# Altium project Tiresias.PrjPcb (part 1 of 2)
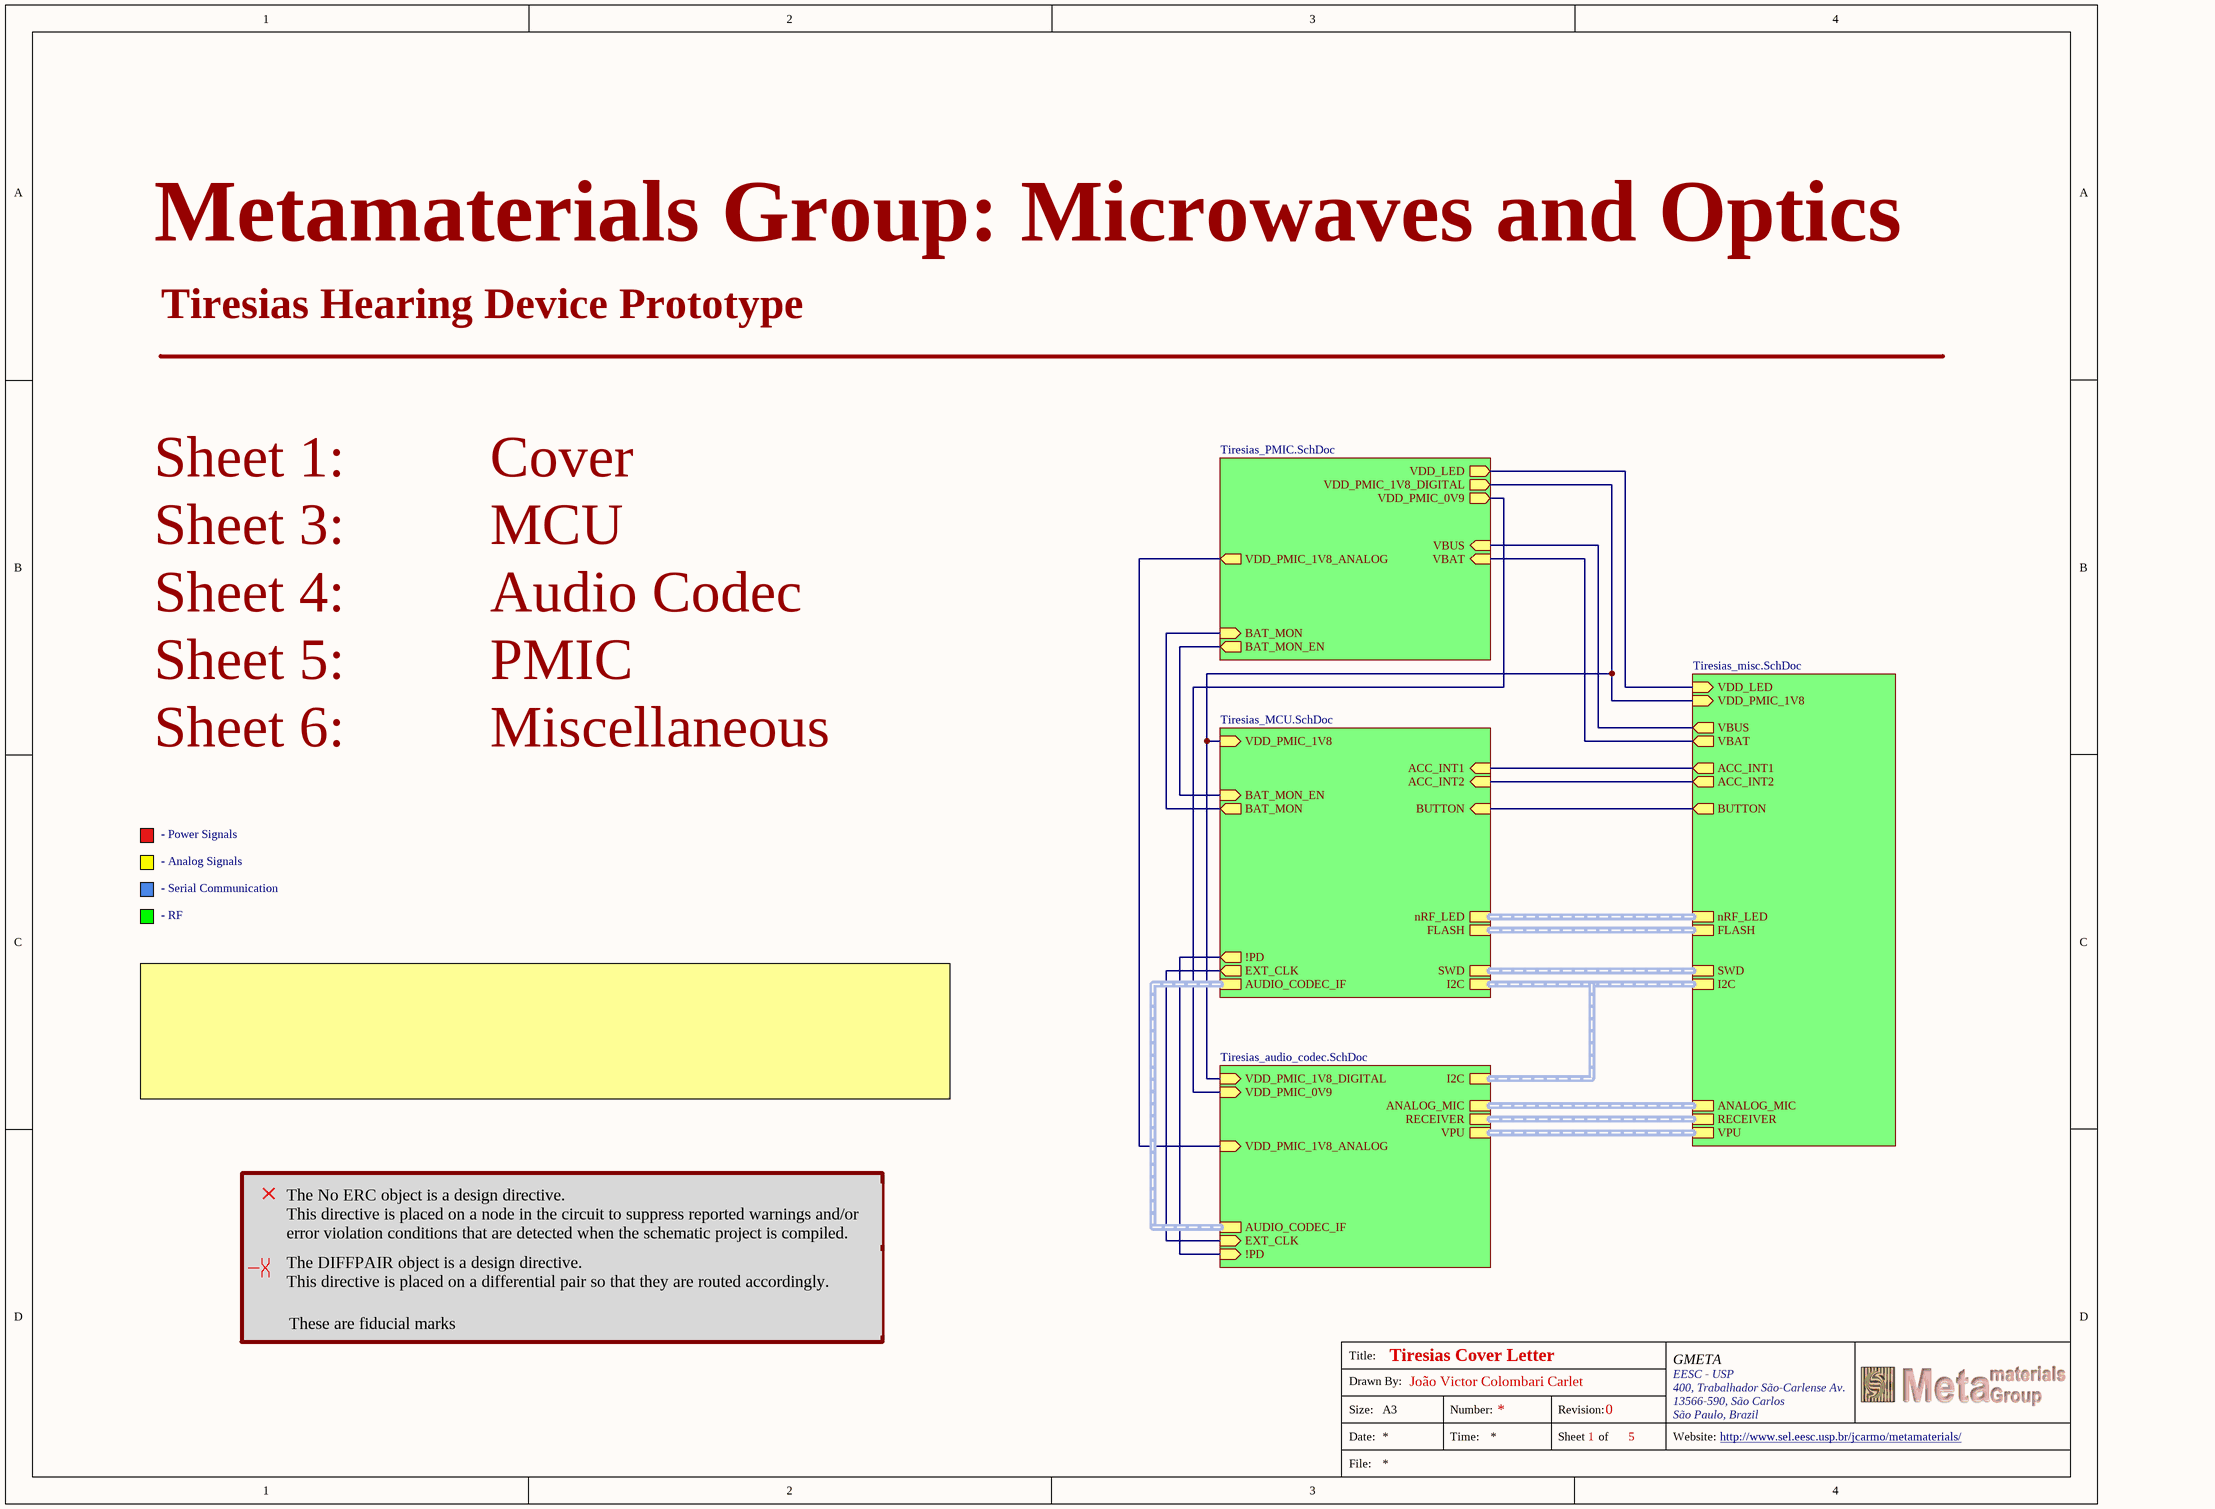
[diagram p0: Tiresias_Cover_letter.SchDoc]
5 sheets, 175 parts. Net scope: hierarchical (ports join the sheet entries above them; power ports are global).
Board file: Tiresias_PCB.PcbDoc
Sheets:
  Tiresias_Cover_letter.SchDoc
    U_Tiresias_MCU = Tiresias_MCU.SchDoc
    U_Tiresias_audio_codec = Tiresias_audio_codec.SchDoc
    U_Tiresias_PMIC = Tiresias_PMIC.SchDoc
    U_Tiresias_misc = Tiresias_misc.SchDoc

## Sheet Tiresias_Cover_letter.SchDoc: Tiresias Cover Letter
size 393 x 281 mm; Author: João Victor Colombari Carlet; CompanyName: GMETA; DrawnBy: João Victor Colombari Carlet; Organization: GMETA; Address1: EESC - USP; Address2: 400, Trabalhador São-Carlense Av.; Address3: 13566-590, São Carlos; Address4: São Paulo, Brazil; Revision: 0; SheetNumber: 1; SheetTotal: 5; Company: USP - GMETA; Address_Website: http://www.sel.eesc.usp.br/jcarmo/metamaterials/

### Sub-sheets
U_Tiresias_audio_codec = Tiresias_audio_codec.SchDoc: RECEIVER (harness RECEIVER), ANALOG_MIC (harness ANALOG_MIC), VPU (harness VPU), AUDIO_CODEC_IF (harness AUDIO_CODEC), I2C (harness I2C), EXT_CLK (in), VDD_PMIC_0V9 (in), !PD (in), VDD_PMIC_1V8_ANALOG (in), VDD_PMIC_1V8_DIGITAL (in)
U_Tiresias_MCU = Tiresias_MCU.SchDoc: SWD (harness SWD), FLASH (harness FLASH), AUDIO_CODEC_IF (harness AUDIO_CODEC), BUTTON (in), VDD_PMIC_1V8 (in), !PD (out), ACC_INT1 (in), ACC_INT2 (in), I2C (harness I2C), EXT_CLK (out), nRF_LED (harness nRF_LED), BAT_MON (out), BAT_MON_EN (in)
U_Tiresias_misc = Tiresias_misc.SchDoc: FLASH (harness FLASH), SWD (harness SWD), BUTTON (out), RECEIVER (harness RECEIVER), ANALOG_MIC (harness ANALOG_MIC), VPU (harness VPU), nRF_LED (harness nRF_LED), VDD_LED (in), ACC_INT1 (out), ACC_INT2 (out), I2C (harness I2C), VBUS (out), VBAT (out), VDD_PMIC_1V8 (in)
U_Tiresias_PMIC = Tiresias_PMIC.SchDoc: VBUS (in), VBAT (in), BAT_MON_EN (out), BAT_MON (in), VDD_LED (out), VDD_PMIC_0V9 (out), VDD_PMIC_1V8_DIGITAL (out), VDD_PMIC_1V8_ANALOG (out)

### Nets
VDD: sheet U_Tiresias_MCU/VDD_PMIC_1V8, sheet U_Tiresias_audio_codec/VDD_PMIC_1V8_DIGITAL, sheet U_Tiresias_PMIC/VDD_PMIC_1V8_DIGITAL, sheet U_Tiresias_misc/VDD_PMIC_1V8
AVDD: sheet U_Tiresias_audio_codec/VDD_PMIC_1V8_ANALOG, sheet U_Tiresias_PMIC/VDD_PMIC_1V8_ANALOG
DVDD_EXT: sheet U_Tiresias_audio_codec/VDD_PMIC_0V9, sheet U_Tiresias_PMIC/VDD_PMIC_0V9
P0.02/NFC1: sheet U_Tiresias_MCU/ACC_INT1, sheet U_Tiresias_misc/ACC_INT1
P0.03/NFC2: sheet U_Tiresias_MCU/ACC_INT2, sheet U_Tiresias_misc/ACC_INT2
P0.29: sheet U_Tiresias_MCU/BUTTON, sheet U_Tiresias_misc/BUTTON
P1.00: sheet U_Tiresias_MCU/!PD, sheet U_Tiresias_audio_codec/!PD
P1.01: sheet U_Tiresias_MCU/EXT_CLK, sheet U_Tiresias_audio_codec/EXT_CLK
P1.04: sheet U_Tiresias_MCU/BAT_MON, sheet U_Tiresias_PMIC/BAT_MON
P1.05: sheet U_Tiresias_MCU/BAT_MON_EN, sheet U_Tiresias_PMIC/BAT_MON_EN
VBAT: sheet U_Tiresias_PMIC/VBAT, sheet U_Tiresias_misc/VBAT
VBUS: sheet U_Tiresias_PMIC/VBUS, sheet U_Tiresias_misc/VBUS
VSYS: sheet U_Tiresias_PMIC/VDD_LED, sheet U_Tiresias_misc/VDD_LED

### Buses and harness runs
harness sheet U_Tiresias_audio_codec/ANALOG_MIC = sheet U_Tiresias_misc/ANALOG_MIC
harness sheet U_Tiresias_audio_codec/AUDIO_CODEC_IF = sheet U_Tiresias_MCU/AUDIO_CODEC_IF
harness sheet U_Tiresias_audio_codec/I2C = sheet U_Tiresias_MCU/I2C = sheet U_Tiresias_misc/I2C
harness sheet U_Tiresias_audio_codec/RECEIVER = sheet U_Tiresias_misc/RECEIVER
harness sheet U_Tiresias_audio_codec/VPU = sheet U_Tiresias_misc/VPU
harness sheet U_Tiresias_MCU/FLASH = sheet U_Tiresias_misc/FLASH
harness sheet U_Tiresias_MCU/nRF_LED = sheet U_Tiresias_misc/nRF_LED
harness sheet U_Tiresias_MCU/SWD = sheet U_Tiresias_misc/SWD

### Layout directives
differential pair: (no net found under the mark)

### Notes on the sheet
- Metamaterials Group: Microwaves and Optics
- Tiresias Hearing Device Prototype
- Sheet 1:          Cover
- Sheet 3:          MCU
- Sheet 4:          Audio Codec
- Sheet 5:          PMIC
- Sheet 6:          Miscellaneous
- - Power Signals
- - Analog Signals
- - Serial Communication
- - RF
- The No ERC object is a design directive.
  This directive is placed on a node in the circuit to suppress reported warnings and/or error violation conditions that are detected when the schematic project is compiled.
- The DIFFPAIR object is a design directive.
  This directive is placed on a differential pair so that they are routed accordingly.
- These are fiducial marks
- Title:
- Drawn By:
- Size:
- Date:
- File:
- A3
- Number:
- Time:
- Revision:
- Sheet
- of
- Website:

## Sheet Tiresias_MCU.SchDoc: MCU
size 393 x 281 mm; Author: João Victor Colombari Carlet; CompanyName: GMETA; DrawnBy: João Victor Colombari Carlet; Organization: GMETA; Address1: EESC - USP; Address2: 400, Trabalhador São-Carlense Av.; Address3: 13566-590, São Carlos; Address4: São Paulo, Brazil; Revision: 0; SheetNumber: 2; SheetTotal: 5; Address_Website: http://www.sel.eesc.usp.br/jcarmo/metamaterials/
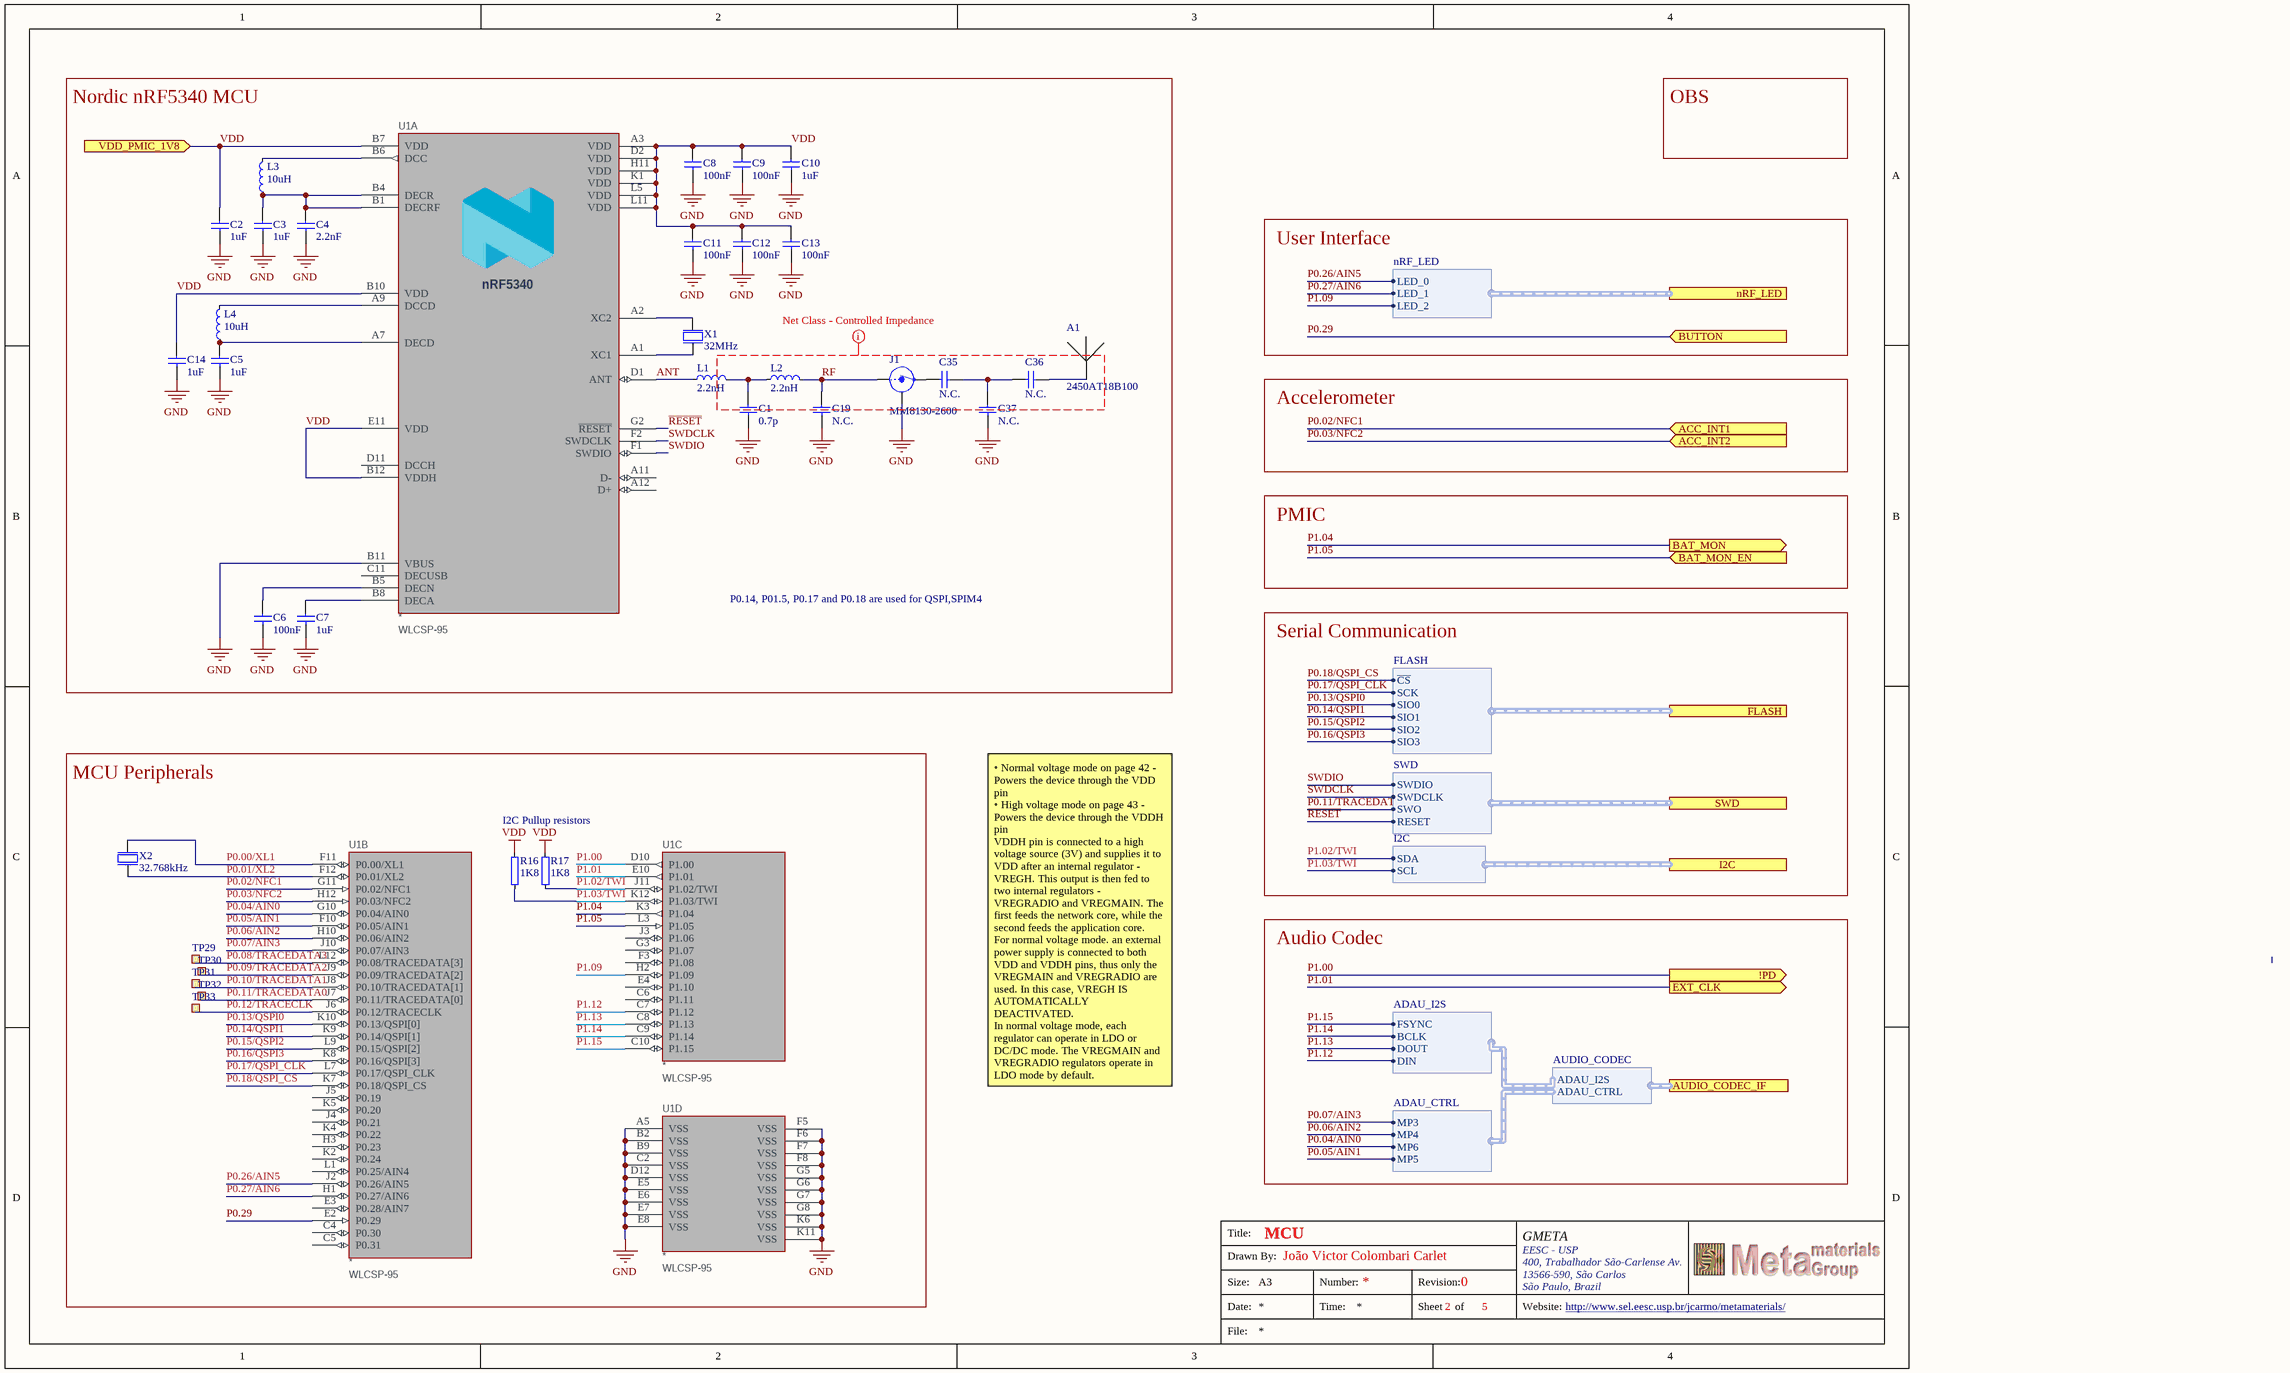
[diagram p1: Tiresias_MCU.SchDoc]

### Parts
A1  2450AT18B100  [2450AT18B100]
C1  0.7p  [CAPC0603X03L_C]
C2  1uF  [CAPC1005X04L]
C3  1uF  [CAPC1005X04L]
C4  2.2nF  [CAPC0603X03L_C]
C5  1uF  [CAPC1005X04L]
C6  100nF  [CAPC0603X03L_C]
C7  1uF  [CAPC1005X04L]
C8  100nF  [CAPC0603X03L_C]
C9  100nF  [CAPC0603X03L_C]
C10  1uF  [CAPC1005X04L]
C11  100nF  [CAPC0603X03L_C]
C12  100nF  [CAPC0603X03L_C]
C13  100nF  [CAPC0603X03L_C]
C14  1uF  [CAPC1005X04L]
C19  N.C.  [CAPC0603X03L_C_NC]
C35  N.C.  [CAPC0603X03L_C_NC]
C36  N.C.  [CAPC0603X03L_C_NC]
C37  N.C.  [CAPC0603X03L_C_NC]
J1  MM8130-2600  [COAXIAL-SWF]
L1  2.2nH  [INDC0603X03L_C]
L2  2.2nH  [INDC0603X03L_C]
L3  10uH  [INDC1608X06L]
L4  10uH  [INDC1608X06L]
R16  1K8  [RESC0603X03L_C]
R17  1K8  [RESC0603X03L_C]
TP29  Ø1.0mm,SMD  [TP_SMD_D1.0mm]  (value not drawn)  (no BOM)
TP30  Ø1.0mm,SMD  [TP_SMD_D1.0mm]  (value not drawn)  (no BOM)
TP31  Ø1.0mm,SMD  [TP_SMD_D1.0mm]  (value not drawn)  (no BOM)
TP32  Ø1.0mm,SMD  [TP_SMD_D1.0mm]  (value not drawn)  (no BOM)
TP33  Ø1.0mm,SMD  [TP_SMD_D1.0mm]  (value not drawn)  (no BOM)
U1  *  Package: WLCSP-95  [BGA95C35P12X11_437X397X50]  (parts A,B,C,D of 4)
X1  32MHz  [BT-XTAL_2016]
X2  32.768kHz  [XTAL_2012]

### Blocks framed on the sheet
Nordic nRF5340 MCU: A1 C1-C14 C19 C35-C37 J1 L1-L4 U1 X1
MCU Peripherals: R16 R17 TP29-TP33 U1 X2

### Ports
!PD (out, see Tiresias_Cover_letter[3C], Tiresias_audio_codec[1C]), ACC_INT1 (in, see Tiresias_Cover_letter[3C], Tiresias_misc[4D]), ACC_INT2 (in, see Tiresias_Cover_letter[3C], Tiresias_misc[4C]), AUDIO_CODEC_IF (harness AUDIO_CODEC, see Tiresias_Cover_letter[3C], Tiresias_audio_codec[3B]), BAT_MON (out, see Tiresias_Cover_letter[3C], Tiresias_PMIC[1C]), BAT_MON_EN (in, see Tiresias_Cover_letter[3C], Tiresias_PMIC[2C]), BUTTON (in, see Tiresias_Cover_letter[3C], Tiresias_misc[2B]), EXT_CLK (out, see Tiresias_Cover_letter[3C], Tiresias_audio_codec[2D]), FLASH (harness FLASH, see Tiresias_Cover_letter[3C], Tiresias_misc[3C]), I2C (harness I2C, see Tiresias_Cover_letter[3C], Tiresias_audio_codec[3C], Tiresias_misc[2C]), nRF_LED (harness nRF_LED, see Tiresias_Cover_letter[3C], Tiresias_misc[1B]), SWD (harness SWD, see Tiresias_Cover_letter[3C], Tiresias_misc[2A]), VDD_PMIC_1V8 (in, see Tiresias_Cover_letter[3B], Tiresias_misc[1A])

### Harnesses
SWD: SWDIO, SWDCLK, SWO, RESET
FLASH: ~{CS}, SCK, SIO0, SIO1, SIO2, SIO3
ADAU_I2S: FSYNC, BCLK, DOUT, DIN
ADAU_CTRL: MP3, MP4, MP6, MP5
AUDIO_CODEC: ADAU_I2S, ADAU_CTRL
I2C: SDA, SCL
nRF_LED: LED_0, LED_1, LED_2

### Nets
GND: C1.1 C2.1 C3.1 C4.1 C5.1 C6.1 C7.1 C8.1 C9.1 C10.1 C11.1 C12.1 C13.1 C14.1 C19.1 C37.1 J1.2(Shield) U1.A5(VSS) U1.B2(VSS) U1.B9(VSS) U1.B11(VBUS) U1.C2(VSS) U1.D12(VSS) U1.E5(VSS) U1.E6(VSS) U1.E7(VSS) U1.E8(VSS) U1.F5(VSS) U1.F6(VSS) U1.F7(VSS) U1.F8(VSS) U1.G5(VSS) U1.G6(VSS) U1.G7(VSS) U1.G8(VSS) U1.K6(VSS) U1.K11(VSS) X1.2(GND) X1.4(GND)
VDD: C2.2 C8.2 C9.2 C10.2 C11.2 C12.2 C13.2 C14.2 R16.2 R17.2 U1.A3(VDD) U1.B7(VDD) U1.B10(VDD) U1.B12(VDDH) U1.D2(VDD) U1.E11(VDD) U1.H11(VDD) U1.K1(VDD) U1.L5(VDD) U1.L11(VDD) ; port VDD_PMIC_1V8
ANT: L1.1 U1.D1(ANT)
P0.00/XL1: U1.F11(P0.00/XL1) X2.2(out)
P0.01/XL2: U1.F12(P0.01/XL2) X2.1(inp)
P0.02/NFC1: U1.G11(P0.02/NFC1) ; port ACC_INT1
P0.03/NFC2: U1.H12(P0.03/NFC2) ; port ACC_INT2
P0.04/AIN0: U1.G10(P0.04/AIN0) ; harness ADAU_CTRL.MP6
P0.05/AIN1: U1.F10(P0.05/AIN1) ; harness ADAU_CTRL.MP5
P0.06/AIN2: U1.H10(P0.06/AIN2) ; harness ADAU_CTRL.MP4
P0.07/AIN3: U1.J10(P0.07/AIN3) ; harness ADAU_CTRL.MP3
P0.08/TRACEDATA3: TP29.1 U1.L12(P0.08/TRACEDATA[3])
P0.09/TRACEDATA2: TP30.1 U1.J9(P0.09/TRACEDATA[2])
P0.10/TRACEDATA1: TP31.1 U1.J8(P0.10/TRACEDATA[1])
P0.11/TRACEDATA0: TP32.1 U1.J7(P0.11/TRACEDATA[0]) ; port SWD.SWO
P0.12/TRACECLK: TP33.1 U1.J6(P0.12/TRACECLK)
P0.13/QSPI0: U1.K10(P0.13/QSPI[0]) ; port FLASH.SIO0
P0.14/QSPI1: U1.K9(P0.14/QSPI[1]) ; port FLASH.SIO1
P0.15/QSPI2: U1.L9(P0.15/QSPI[2]) ; port FLASH.SIO2
P0.16/QSPI3: U1.K8(P0.16/QSPI[3]) ; port FLASH.SIO3
P0.17/QSPI_CLK: U1.L7(P0.17/QSPI_CLK) ; port FLASH.SCK
P0.18/QSPI_CS: U1.K7(P0.18/QSPI_CS) ; port FLASH.~{CS}
P0.26/AIN5: U1.J2(P0.26/AIN5) ; port nRF_LED.LED_0
P0.27/AIN6: U1.H1(P0.27/AIN6) ; port nRF_LED.LED_1
P0.29: U1.E2(P0.29) ; port BUTTON
P1.00: U1.D10(P1.00) ; port !PD
P1.01: U1.E10(P1.01) ; port EXT_CLK
P1.02/TWI: R17.1 U1.J11(P1.02/TWI) ; port I2C.SDA
P1.03/TWI: R16.1 U1.K12(P1.03/TWI) ; port I2C.SCL
P1.04: U1.K3(P1.04) ; port BAT_MON
P1.05: U1.L3(P1.05) ; port BAT_MON_EN
P1.09: U1.H2(P1.09) ; port nRF_LED.LED_2
P1.12: U1.C7(P1.12) ; harness ADAU_I2S.DIN
P1.13: U1.C8(P1.13) ; harness ADAU_I2S.DOUT
P1.14: U1.C9(P1.14) ; harness ADAU_I2S.BCLK
P1.15: U1.C10(P1.15) ; harness ADAU_I2S.FSYNC
~{RESET}: U1.G2(~{RESET}) ; port SWD.RESET
RF: C19.2 J1.1(IN) L2.2
SWDCLK: U1.F2(SWDCLK) ; port SWD.SWDCLK
SWDIO: U1.F1(SWDIO) ; port SWD.SWDIO
NetA1_1: A1.1 C36.1
NetC1_2: C1.2 L1.2 L2.1
NetC3_2: C3.2 C4.2 L3.1 U1.B1(DECRF) U1.B4(DECR)
NetC5_2: C5.2 L4.1 U1.A7(DECD)
NetC6_2: C6.2 U1.B5(DECN)
NetC7_2: C7.2 U1.B8(DECA)
NetC35_1: C35.1 J1.3(OUT)
NetC35_2: C35.2 C36.2 C37.2
NetL3_2: L3.2 U1.B6(DCC)
NetL4_2: L4.2 U1.A9(DCCD)
NetU1_A1: U1.A1(XC1) X1.1(inp)
NetU1_A2: U1.A2(XC2) X1.3(out)

Not connected (* = marked no-connect by the designer): U1 A11(D-) A12(D+) C4(P0.30) C5(P0.31) C6(P1.11) C11(DECUSB) D11(DCCH) E3(P0.28/AIN7) E4(P1.10) F3(P1.08) G3(P1.07) H3(P0.23) J3(P1.06) J4(P0.21) J5(P0.19) K2(P0.24) K4(P0.22) K5(P0.20) L1(P0.25/AIN4)

### Layout directives
net class controlled_impedance: RF

### Notes on the sheet
- OBS
- User Interface
- Accelerometer
- PMIC
- P0.14, P01.5, P0.17 and P0.18 are used for QSPI,SPIM4
- Serial Communication
- I2C Pullup resistors
- Audio Codec
- • Normal voltage mode on page 42 - Powers the device through the VDD pin
  • High voltage mode on page 43 - Powers the device through the VDDH pin
  VDDH pin is connected to a high voltage source (3V) and supplies it to VDD after an internal regulator - VREGH. This output is then fed to two internal regulators - VREGRADIO and VREGMAIN. The first feeds the network core, while the second feeds the application core.
  For normal voltage mode. an external power supply is connected to both VDD and VDDH pins, thus only the VREGMAIN and VREGRADIO are used. In this case, VREGH IS AUTOMATICALLY DEACTIVATED.
  In normal voltage mode, each regulator can operate in LDO or DC/DC mode. The VREGMAIN and VREGRADIO regulators operate in LDO mode by default.
  Operating a regulator in DC/DC mode reduces the overall power consumption due to higher efficiency than in LDO mode.
- Title:
- Drawn By:
- Size:
- Date:
- File:
- A3
- Number:
- Time:
- Revision:
- Sheet
- of
- Website:
- (in symbol nRF5340-CLAA, part A) nRF5340

### Library data of the parts
A1 = Johanson 2450AT18B100: 2.45 GHz chip antenna; Manufacturer: Johanson Technology; Part number IPS: 00000007781; Note: N.A.; Pad Count: 2; Part Number: Johanson 2450AT18B100; Manufacturer Part Number: 2450AT18B100; ComponentLink1URL: N.A.; ComponentLink1Description: Datasheet; ComponentLink2URL: N.A.; ComponentLink2Description: Supplier link; HelpURL: http://www.johansontechnology.com/datasheets/antennas/2450AT18B100.pdf; Footprint Doc: 2450AT18B100; LatestRevisionDate: 2013-09-13; Published: 2013-09-13; Value: 2450AT18B100; Supplier 1: Digi-Key; Supplier Part Number 1: 712-1006-1-ND; Supplier 2: N.A.; Supplier Part Number 2: N.A.; Artikkelnr Noca: N.A.; Component Class: Antennas; PartId: 100700001; Author: rsk; Part number Norautron: N.A.
C1 = CAP_0201_0p7: Capacitor, NP0, ±2%; Part Number: C0201-0p7; Class: SMT; Manufacturer: *; Manufacturer Part Number: *; LatestRevisionDate: 2024-03-04; Value: 0.7p; Package: 0201; Pin Count: 2; JLCpcb link: *; Mouser link: *; DigiKey link: *
C2 C3 C5 C7 C10 C14 = CAP_0402_1uF: Capacitor, X5R, ±5%; Part Number: C0402-1µ0; Class: SMT; Manufacturer: *; Manufacturer Part Number: *; LatestRevisionDate: 2024/02/20; Value: 1uF; Package: 0402; Pin Count: 2
C4 = CAP_0201_2n2: Capacitor, NP0, ±2%; Part Number: C0201-2n2; Class: SMT; Manufacturer: *; Manufacturer Part Number: *; LatestRevisionDate: 2024/03/02; Package: 0201; Pin Count: 2; JLCpcb link: *; Mouser link: *; DigiKey link: *; Value: 2.2nF
C6 C8 C9 C11-C13 = CAP_0201_100nF: Capacitor, NP0, ±2%; Part Number: C0201-100n; Class: SMT; Manufacturer: *; Manufacturer Part Number: *; LatestRevisionDate: 2024/02/20; Value: 100nF; Package: 0201; Pin Count: 2; JLCpcb link: *; Mouser link: *; DigiKey link: *
C19 C35-C37 = CAP_0201_NC: Capacitor, NP0, ±2%; Part Number: C0201-NC; Manufacturer: *; Manufacturer Part Number: *; LatestRevisionDate: 2024-03-04; Value: N.C.; Package: *; Pin Count: 2; Class: *; JLCpcb link: *; Mouser link: *; DigiKey link: *
J1 = MM8130-2600: Coaxial Connector with Switch; Manufacturer: Murata; Part number IPS: 00000009955; Note: N.A.; Artikkelnr Noca: 55029011; Pad Count: 3; Part Number: MM8130-2600; Manufacturer Part Number: MM8130-2600; LatestRevisionDate: 2014-04-24; Published: 2014-04-24; Value: MM8130-2600; Footprint Doc: COAXIAL-SWF; ComponentLink1URL: N.A.; ComponentLink1Description: Datasheet; ComponentLink2URL: N.A.; ComponentLink2Description: Supplier link; HelpURL: http://www.murata.com/products/catalog/pdf/o33e.pdf; Supplier 1: Digi-Key; Supplier Part Number 1: 490-4981-1-ND; Supplier 2: Mouser; Supplier Part Number 2: 81-MM8130-2600RA2; PartId: 100500400; Component Class: Connectors; Author: rsk; Part number Norautron: N.A.
L1 L2 = IND_0201_2n2H: High frequency chip inductor ±5%; Part Number: L0201-2n2; Class: SMT; Manufacturer: *; Manufacturer Part Number: *; LatestRevisionDate: 2024/02/20; Value: 2.2nH; Package: 0201; Pin Count: 2
L3 L4 = IND_0603_10uH: Chip inductor, IDC,min = 50 mA, ±20%; Part Number: L0603-10µ; Class: SMT; LatestRevisionDate: 2024/02/20; Value: 10uH; Package: 0603; Pin Count: 2
R16 R17 = RES_0201_1K8: Resistor, ±1%, 0.05W; Part Number: R0201-100k; Manufacturer: N.A.; Class: SMT; Latest Revision Date: 2024-04-23; ComponentLink1URL: N.A.; ComponentLink1Description: Datasheet; ComponentLink2URL: N.A.; ComponentLink2Description: Supplier link; Value: 1K8; Package: 0201; Pin Count: 2; JLCpcb link: Chip Res 1%; Mouser link: N.A.; DigiKey link: 00000001419; Author: rsk
TP29-TP33 = TP_SMD_Ø1.0MM: 1.0mm circular SMD testpad; Manufacturer: Nordic Semiconductor; Manufacturer Part Number: N.A.; Pad Count: 1; Part Number: TP_SMD_Ø1.0MM; ComponentLink1URL: N.A.; ComponentLink1Description: Datasheet; ComponentLink2URL: N.A.; ComponentLink2Description: Supplier link; HelpURL: N.A.; Footprint Doc: TP_SMD_Ø1.0mm; LatestRevisionDate: 2021-03-05; Published: 2013-06-11; Value: Ø1.0mm,SMD; Note: N.A.; Supplier 1: N.A.; Supplier Part Number 1: N.A.; Supplier 2: N.A.; Supplier Part Number 2: N.A.; Artikkelnr Noca: N.A.; Part number IPS: N.A.; Component Class: Connectors; PartId: 100500475; Author: rsk; Part number Norautron: N.A.
U1 = nRF5340-CLAA: Multi-protocol Bluetooth Low Energy, IEEE 802.15.4, ANT and 2.4GHz proprietary system-on-chip; Manufacturer: Nordic Semiconductors; Class: logic; Part Number: nRF5340-CLAA; Manufacturer Part Number: nRF5340-CLAA; Latest Revision Date: 2024/03/04; Value: *; Pin Count: 95; JLCpcb link: *; Mouser link: *; DigiKey link: *
X1 = XTAL_SMD2016_32MHz: XTAL SMD 2016, 32MHz, Cl=8pF, Total Tol: ±40ppm; Part Number: XTAL_SMD2016_32MHz_8pF_General; Class: SMT; Manufacturer: *; Manufacturer Part Number: *; LatestRevisionDate: 2024/02/20; Value: 32MHz; Package: 2016; Pin Count: 4
X2 = XTAL_SMD2012_32k768Hz: XTAL SMD 2012, 32.768kHz, Cl=9pF, Total Tol: ±50ppm; Part Number: XTAL_SMD2012_32.768kHz_9pF_General; Class: SMT; Manufacturer: *; Manufacturer Part Number: *; LatestRevisionDate: 2024/02/20; Value: 32.768kHz; Package: 2012; Pin Count: 4

## Sheet Tiresias_audio_codec.SchDoc: Audio Codec
size 393 x 281 mm; Author: João Victor Colombari Carlet; CompanyName: GMETA; DrawnBy: João Victor Colombari Carlet; Organization: R&D GMETA; Address1: EESC - USP; Address2: 400, Trabalhador São-Carlense Av.; Address3: 13566-590, São Carlos; Address4: São Paulo, Brazil; Revision: 0; SheetNumber: 3; SheetTotal: 5; Address_Website: http://www.sel.eesc.usp.br/jcarmo/metamaterials/
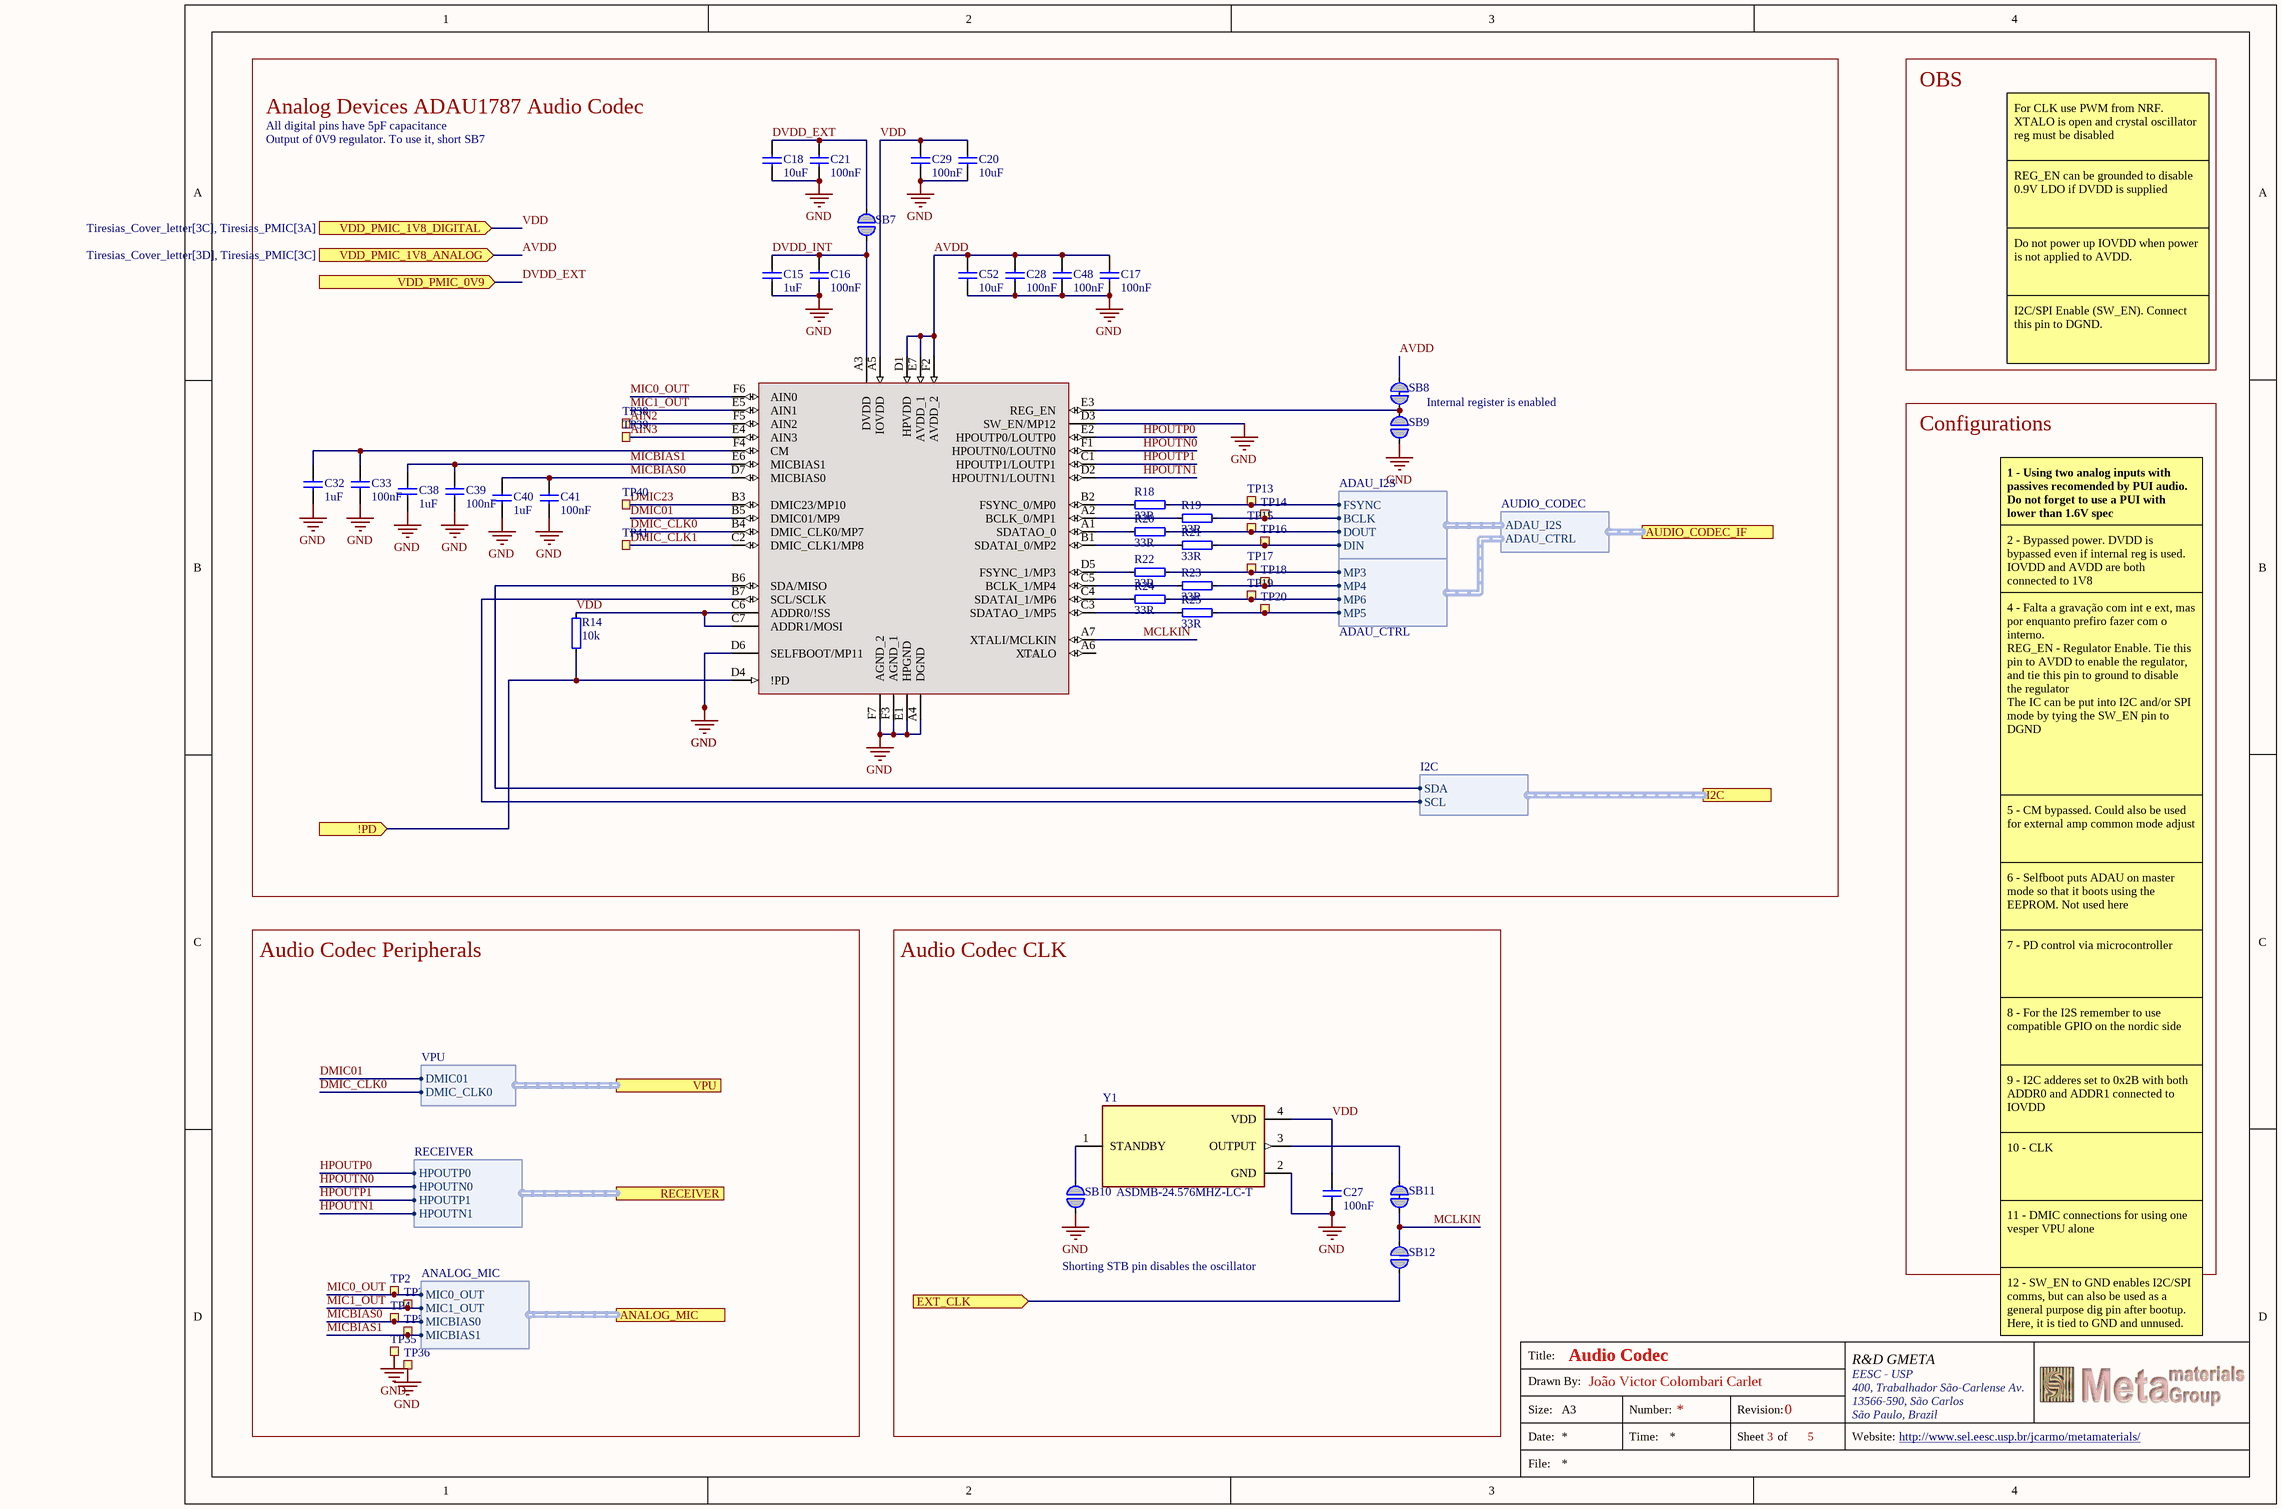
[diagram p2: Tiresias_audio_codec.SchDoc]

### Parts
C15  1uF  [CAPC1005X04L]
C16  100nF  [CAPC0603X03L_C]
C17  100nF  [CAPC0603X03L_C]
C18  10uF  [CAPC1005X04L]
C20  10uF  [CAPC1005X04L]
C21  100nF  [CAPC0603X03L_C]
C27  100nF  [CAPC0603X03L_C]
C28  100nF  [CAPC0603X03L_C]
C29  100nF  [CAPC0603X03L_C]
C32  1uF  [CAPC1005X04L]
C33  100nF  [CAPC0603X03L_C]
C38  1uF  [CAPC1005X04L]
C39  100nF  [CAPC0603X03L_C]
C40  1uF  [CAPC1005X04L]
C41  100nF  [CAPC0603X03L_C]
C48  100nF  [CAPC0603X03L_C]
C52  10uF  [CAPC1005X04L]
IC1  General Purpose Audio Codec 4ADC / 2DAC Ch 42-Pin WLCSP T/R   Source:  Datasheet  [BGA42C35P7X6_270X232X53]  (value not drawn)
R14  10k  [RESC0603X03L_C]
R18  33R  [RESC0603X03L_C]
R19  33R  [RESC0603X03L_C]
R20  33R  [RESC0603X03L_C]
R21  33R  [RESC0603X03L_C]
R22  33R  [RESC0603X03L_C]
R23  33R  [RESC0603X03L_C]
R24  33R  [RESC0603X03L_C]
R25  33R  [RESC0603X03L_C]
SB7  Solderbridge  [Solderbridge]  (value not drawn)  (no BOM)
SB8  Solderbridge  [Solderbridge_Shorted]  (value not drawn)  (net tie, no BOM)
SB9  Solderbridge  [Solderbridge]  (value not drawn)  (no BOM)
SB10  Solderbridge  [Solderbridge]  (value not drawn)  (no BOM)
SB11  Solderbridge  [Solderbridge_Shorted]  (value not drawn)  (net tie, no BOM)
SB12  Solderbridge  [Solderbridge]  (value not drawn)  (no BOM)
TP2  Ø1.0mm,SMD  [TP_SMD_D1.0mm]  (value not drawn)  (no BOM)
TP3  Ø1.0mm,SMD  [TP_SMD_D1.0mm]  (value not drawn)  (no BOM)
TP4  Ø1.0mm,SMD  [TP_SMD_D1.0mm]  (value not drawn)  (no BOM)
TP5  Ø1.0mm,SMD  [TP_SMD_D1.0mm]  (value not drawn)  (no BOM)
TP13  Ø1.0mm,SMD  [TP_SMD_D1.0mm]  (value not drawn)  (no BOM)
TP14  Ø1.0mm,SMD  [TP_SMD_D1.0mm]  (value not drawn)  (no BOM)
TP15  Ø1.0mm,SMD  [TP_SMD_D1.0mm]  (value not drawn)  (no BOM)
TP16  Ø1.0mm,SMD  [TP_SMD_D1.0mm]  (value not drawn)  (no BOM)
TP17  Ø1.0mm,SMD  [TP_SMD_D1.0mm]  (value not drawn)  (no BOM)
TP18  Ø1.0mm,SMD  [TP_SMD_D1.0mm]  (value not drawn)  (no BOM)
TP19  Ø1.0mm,SMD  [TP_SMD_D1.0mm]  (value not drawn)  (no BOM)
TP20  Ø1.0mm,SMD  [TP_SMD_D1.0mm]  (value not drawn)  (no BOM)
TP35  Ø1.0mm,SMD  [TP_SMD_D1.0mm]  (value not drawn)  (no BOM)
TP36  Ø1.0mm,SMD  [TP_SMD_D1.0mm]  (value not drawn)  (no BOM)
TP38  Ø1.0mm,SMD  [TP_SMD_D1.0mm]  (value not drawn)  (no BOM)
TP39  Ø1.0mm,SMD  [TP_SMD_D1.0mm]  (value not drawn)  (no BOM)
TP40  Ø1.0mm,SMD  [TP_SMD_D1.0mm]  (value not drawn)  (no BOM)
TP41  Ø1.0mm,SMD  [TP_SMD_D1.0mm]  (value not drawn)  (no BOM)
Y1  ASDMB-24.576MHZ-LC-T  [XTAL_ASDMB-24.576MHZ-LC-T]

### Blocks framed on the sheet
Analog Devices ADAU1787 Audio Codec: C15-C18 C20 C21 C28 C29 C32 C33 C38-C41 C48 C52 IC1 R14 R18-R25 SB7-SB9 TP13-TP20 TP38-TP41
Audio Codec Peripherals: TP2-TP5 TP35 TP36
Audio Codec CLK: C27 SB10-SB12 Y1

### Ports
!PD (in, see Tiresias_Cover_letter[3D], Tiresias_MCU[4C]), ANALOG_MIC (harness ANALOG_MIC, see Tiresias_Cover_letter[3C], Tiresias_misc[2C]), AUDIO_CODEC_IF (harness AUDIO_CODEC, see Tiresias_Cover_letter[3D], Tiresias_MCU[4D]), EXT_CLK (in, see Tiresias_Cover_letter[3D], Tiresias_MCU[4C]), I2C (harness I2C, see Tiresias_Cover_letter[3C], Tiresias_MCU[4C], Tiresias_misc[2C]), RECEIVER (harness RECEIVER, see Tiresias_Cover_letter[3C], Tiresias_misc[4B]), VDD_PMIC_0V9 (in, see Tiresias_Cover_letter[3C], Tiresias_PMIC[3C]), VDD_PMIC_1V8_ANALOG (in, see Tiresias_Cover_letter[3D], Tiresias_PMIC[3C]), VDD_PMIC_1V8_DIGITAL (in, see Tiresias_Cover_letter[3C], Tiresias_PMIC[3A]), VPU (harness VPU, see Tiresias_Cover_letter[3D], Tiresias_misc[4A])

### Harnesses
ANALOG_MIC: MIC0_OUT, MIC1_OUT, MICBIAS0, MICBIAS1
I2C: SDA, SCL
VPU: DMIC01, DMIC_CLK0
RECEIVER: HPOUTP0, HPOUTN0, HPOUTP1, HPOUTN1
ADAU_I2S: FSYNC, BCLK, DOUT, DIN
ADAU_CTRL: MP3, MP4, MP6, MP5
AUDIO_CODEC: ADAU_I2S, ADAU_CTRL

### Nets
GND: C15.1 C16.2 C17.2 C18.1 C20.1 C21.2 C27.2 C28.2 C29.2 C32.1 C33.2 C38.1 C39.2 C40.1 C41.2 C48.2 C52.1 IC1.A4(DGND) IC1.D3(SW_EN/MP12) IC1.D6(SELFBOOT/MP11) IC1.E1(HPGND) IC1.F3(AGND_1) IC1.F7(AGND_2) SB9.2 SB10.2 TP35.1 TP36.1 Y1.2(GND)
VDD: C20.2 C27.1 C29.1 IC1.A5(IOVDD) IC1.C6(ADDR0/!SS) IC1.C7(ADDR1/MOSI) R14.2 Y1.4(VDD) ; port VDD_PMIC_1V8_DIGITAL
AIN2: IC1.F5(AIN2) TP38.1
AIN3: IC1.E4(AIN3) TP39.1
AVDD: C17.1 C28.1 C48.1 C52.2 IC1.D1(HPVDD) IC1.E7(AVDD_1) IC1.F2(AVDD_2) SB8.1 ; port VDD_PMIC_1V8_ANALOG
DMIC01: IC1.B5(DMIC01/MP9) ; port VPU.DMIC01
DMIC23: IC1.B3(DMIC23/MP10) TP40.1
DMIC_CLK0: IC1.B4(DMIC_CLK0/MP7) ; port VPU.DMIC_CLK0
DMIC_CLK1: IC1.C2(DMIC_CLK1/MP8) TP41.1
DVDD_EXT: C18.2 C21.1 SB7.1 ; port VDD_PMIC_0V9
DVDD_INT: C15.2 C16.1 IC1.A3(DVDD) SB7.2
HPOUTN0: IC1.F1(HPOUTN0/LOUTN0) ; port RECEIVER.HPOUTN0
HPOUTN1: IC1.D2(HPOUTN1/LOUTN1) ; port RECEIVER.HPOUTN1
HPOUTP0: IC1.E2(HPOUTP0/LOUTP0) ; port RECEIVER.HPOUTP0
HPOUTP1: IC1.C1(HPOUTP1/LOUTP1) ; port RECEIVER.HPOUTP1
MCLKIN: IC1.A7(XTALI/MCLKIN) SB11.2 SB12.1
MIC0_OUT: IC1.F6(AIN0) TP2.1 ; port ANALOG_MIC.MIC0_OUT
MIC1_OUT: IC1.E5(AIN1) TP3.1 ; port ANALOG_MIC.MIC1_OUT
MICBIAS0: C40.2 C41.1 IC1.D7(MICBIAS0) TP4.1 ; port ANALOG_MIC.MICBIAS0
MICBIAS1: C38.2 C39.1 IC1.E6(MICBIAS1) TP5.1 ; port ANALOG_MIC.MICBIAS1
P0.04/AIN0: R24.2 TP19.1 ; harness ADAU_CTRL.MP6
P0.05/AIN1: R25.2 TP20.1 ; harness ADAU_CTRL.MP5
P0.06/AIN2: R23.2 TP18.1 ; harness ADAU_CTRL.MP4
P0.07/AIN3: R22.2 TP17.1 ; harness ADAU_CTRL.MP3
P1.00: IC1.D4(!PD) R14.1 ; port !PD
P1.01: SB12.2 ; port EXT_CLK
P1.02/TWI: IC1.B6(SDA/MISO) ; port I2C.SDA
P1.03/TWI: IC1.B7(SCL/SCLK) ; port I2C.SCL
P1.12: R21.2 TP16.1 ; harness ADAU_I2S.DIN
P1.13: R20.2 TP15.1 ; harness ADAU_I2S.DOUT
P1.14: R19.2 TP14.1 ; harness ADAU_I2S.BCLK
P1.15: R18.2 TP13.1 ; harness ADAU_I2S.FSYNC
NetC32_2: C32.2 C33.1 IC1.F4(CM)
NetIC1_A1: IC1.A1(SDATAO_0) R20.1
NetIC1_A2: IC1.A2(BCLK_0/MP1) R19.1
NetIC1_B1: IC1.B1(SDATAI_0/MP2) R21.1
NetIC1_B2: IC1.B2(FSYNC_0/MP0) R18.1
NetIC1_C3: IC1.C3(SDATAO_1/MP5) R25.1
NetIC1_C4: IC1.C4(SDATAI_1/MP6) R24.1
NetIC1_C5: IC1.C5(BCLK_1/MP4) R23.1
NetIC1_D5: IC1.D5(FSYNC_1/MP3) R22.1
NetIC1_E3: IC1.E3(REG_EN) SB8.2 SB9.1
NetSB10_1: SB10.1 Y1.1(STANDBY)
NetSB11_1: SB11.1 Y1.3(OUTPUT)

Not connected (* = marked no-connect by the designer): IC1 A6(XTALO)

### Notes on the sheet
- OBS
- Output of 0V9 regulator. To use it, short SB7
- All digital pins have 5pF capacitance
- For CLK use PWM from NRF. XTALO is open and crystal oscillator reg must be disabled
- REG_EN can be grounded to disable 0.9V LDO if DVDD is supplied
- Do not power up IOVDD when power is not applied to AVDD.
- I2C/SPI Enable (SW_EN). Connect this pin to DGND.
- Internal register is enabled
- Configurations
- 1 - Using two analog inputs with passives recomended by PUI audio. Do not forget to use a PUI with lower than 1.6V spec
- 2 - Bypassed power. DVDD is bypassed even if internal reg is used. IOVDD and AVDD are both connected to 1V8
- 4 - Falta a gravação com int e ext, mas por enquanto prefiro fazer com o interno.
  REG_EN - Regulator Enable. Tie this pin to AVDD to enable the regulator, and tie this pin to ground to disable the regulator
  The IC can be put into I2C and/or SPI mode by tying the SW_EN pin to DGND
- 5 - CM bypassed. Could also be used for external amp common mode adjust
- 6 - Selfboot puts ADAU on master mode so that it boots using the EEPROM. Not used here
- 7 - PD control via microcontroller
- 8 - For the I2S remember to use compatible GPIO on the nordic side
- 9 - I2C adderes set to 0x2B with both ADDR0 and ADDR1 connected to IOVDD
- 11 - DMIC connections for using one vesper VPU alone
- 10 - CLK
- Shorting STB pin disables the oscillator
- 12 - SW_EN to GND enables I2C/SPI comms, but can also be used as a general purpose dig pin after bootup. Here, it is tied to GND and unnused.
- Title:
- Drawn By:
- Size:
- Date:
- File:
- A3
- Number:
- Time:
- Revision:
- Sheet
- of
- Website:

### Library data of the parts
C15 C32 C38 C40 = CAP_0402_1uF: as C2 on sheet Tiresias_MCU; Manufacturer: *; Manufacturer Part Number: *; LatestRevisionDate: 2024/02/20; Value: 1uF; Package: 0402; Pin Count: 2
C16 C17 C21 C27-C29 C33 C39 C41 C48 = CAP_0201_100nF: as C6 on sheet Tiresias_MCU; Manufacturer: *; Manufacturer Part Number: *; LatestRevisionDate: 2024/02/20; Value: 100nF; Package: 0201; Pin Count: 2; JLCpcb link: *; Mouser link: *; DigiKey link: *
C18 C20 C52 = CAP_0402_10uF: Capacitor, X5R, ±5%; Part Number: C0402-1µ0; Class: SMT; Manufacturer: *; Manufacturer Part Number: *; LatestRevisionDate: 2024/02/20; Value: 10uF; Package: 0402; Pin Count: 2
IC1 = ADAU1787BCBZRL: Manufacturer_Name: Analog Devices; GateName_1: G$1; SymbolName_1: ADAU1787BCBZRL; LibraryName: ADAU1787BCBZRL; DeviceSetName: ADAU1787BCBZRL; Package: BGA42C35P7X6_270X232X53; Mouser_Part_Number: 584-ADAU1787BCBZRL; Mouser_Price-Stock: https://www.mouser.co.uk/ProductDetail/Analog-Devices/ADAU1787BCBZRL?qs=Zz7%252BYVVL6bEB%252B919c1w04A%3D%3D; Manufacturer_Part_Number: ADAU1787BCBZRL; Height: 0.53mm
R14 = RES_0201_10K: Resistor, ±1%, 0.05W; Part Number: R0201-100k; Manufacturer: N.A.; Class: SMT; Latest Revision Date: 2024-04-23; ComponentLink1URL: N.A.; ComponentLink1Description: Datasheet; ComponentLink2URL: N.A.; ComponentLink2Description: Supplier link; Value: 10k; Package: 0201; Pin Count: 2; JLCpcb link: Chip Res 1%; Mouser link: N.A.; DigiKey link: 00000001419; Author: rsk
R18-R25 = RES_0201_33R: Resistor, ±1%, 0.05W; Part Number: R0201-220; Manufacturer: N.A.; Part number IPS: 00000000863; Pad Count: 2; Note: Chip Res 1%; Footprint Doc: 0201; Value: 33R; Component Class: Resistors; Author: rsk; PartId: 100100032; Manufacturer Part Number: N.A.; ComponentLink1URL: N.A.; ComponentLink1Description: Datasheet; ComponentLink2URL: N.A.; ComponentLink2Description: Supplier link; HelpURL: N.A.; LatestRevisionDate: 2014-11-13; Published: 2014-11-13; Supplier 1: N.A.; Supplier Part Number 1: N.A.; Supplier 2: N.A.; Supplier Part Number 2: N.A.; Artikkelnr Noca: N.A.; Part number Norautron: N.A.
SB7 SB9 SB10 SB12 = Solderbridge: Manufacturer: N.A.; Pad Count: 2; Part Number: Solderbridge; Manufacturer Part Number: N.A.; ComponentLink1URL: N.A.; ComponentLink1Description: Datasheet; ComponentLink2URL: N.A.; ComponentLink2Description: Supplier link; HelpURL: N.A.; Footprint Doc: Solderbridge; LatestRevisionDate: 2009-12-14; Published: 2009-12-14; Value: Solderbridge; Note: N.A.; Supplier 1: N.A.; Supplier Part Number 1: N.A.; Supplier 2: N.A.; Supplier Part Number 2: N.A.; Artikkelnr Noca: N.A.; Part number IPS: N.A.; Component Class: Connectors; PartId: 100500458; Author: rsk; Part number Norautron: N.A.
SB8 SB11 = Solderbridge Shorted: Shorted Solderbridge; Manufacturer: N.A.; Pad Count: 2; Part Number: Solderbridge Shorted; Manufacturer Part Number: N.A.; ComponentLink1URL: N.A.; ComponentLink1Description: Datasheet; ComponentLink2URL: N.A.; ComponentLink2Description: Supplier link; HelpURL: N.A.; Footprint Doc: Solderbridge_Shorted; LatestRevisionDate: 2012-08-07; Published: 2012-08-07; Value: Solderbridge; Note: N.A.; Supplier 1: N.A.; Supplier Part Number 1: N.A.; Supplier 2: N.A.; Supplier Part Number 2: N.A.; Artikkelnr Noca: N.A.; Part number IPS: N.A.; Component Class: Connectors; PartId: 100500459; Author: rsk; Part number Norautron: N.A.
TP2-TP5 TP13-TP20 TP35 TP36 TP38-TP41 = TP_SMD_Ø1.0MM: as TP29 on sheet Tiresias_MCU; Part Number: TP_SMD_Ø1.0MM; ComponentLink1URL: N.A.; ComponentLink1Description: Datasheet; ComponentLink2URL: N.A.; ComponentLink2Description: Supplier link; HelpURL: N.A.; Footprint Doc: TP_SMD_Ø1.0mm; LatestRevisionDate: 2021-03-05; Published: 2013-06-11; Value: Ø1.0mm,SMD; Note: N.A.; Supplier 1: N.A.; Supplier Part Number 1: N.A.; Supplier 2: N.A.; Supplier Part Number 2: N.A.; Artikkelnr Noca: N.A.; Part number IPS: N.A.; Component Class: Connectors; PartId: 100500475; Author: rsk; Part number Norautron: N.A.
Y1 = ASDMB-24.576MHZ-LC-T: Package: None; Price: None; Availability: Unavailable; MP: ASDMB-24.576MHZ-LC-T; Value: *

## Sheet Tiresias_PMIC.SchDoc: Tiresias PMIC
size 393 x 281 mm; Author: João Victor Colombari Carlet; CompanyName: GMETA; DrawnBy: João Victor Colombari Carlet; Engineer: João Victor Colombari Carlet; Organization: R&D GMETA; Address1: EESC - USP; Address2: 400, Trabalhador São-Carlense Av.; Address3: 13566-590, São Carlos; Address4: São Paulo, Brazil; Revision: 0; SheetNumber: 4; SheetTotal: 5; Address_Website: http://www.sel.eesc.usp.br/jcarmo/metamaterials/
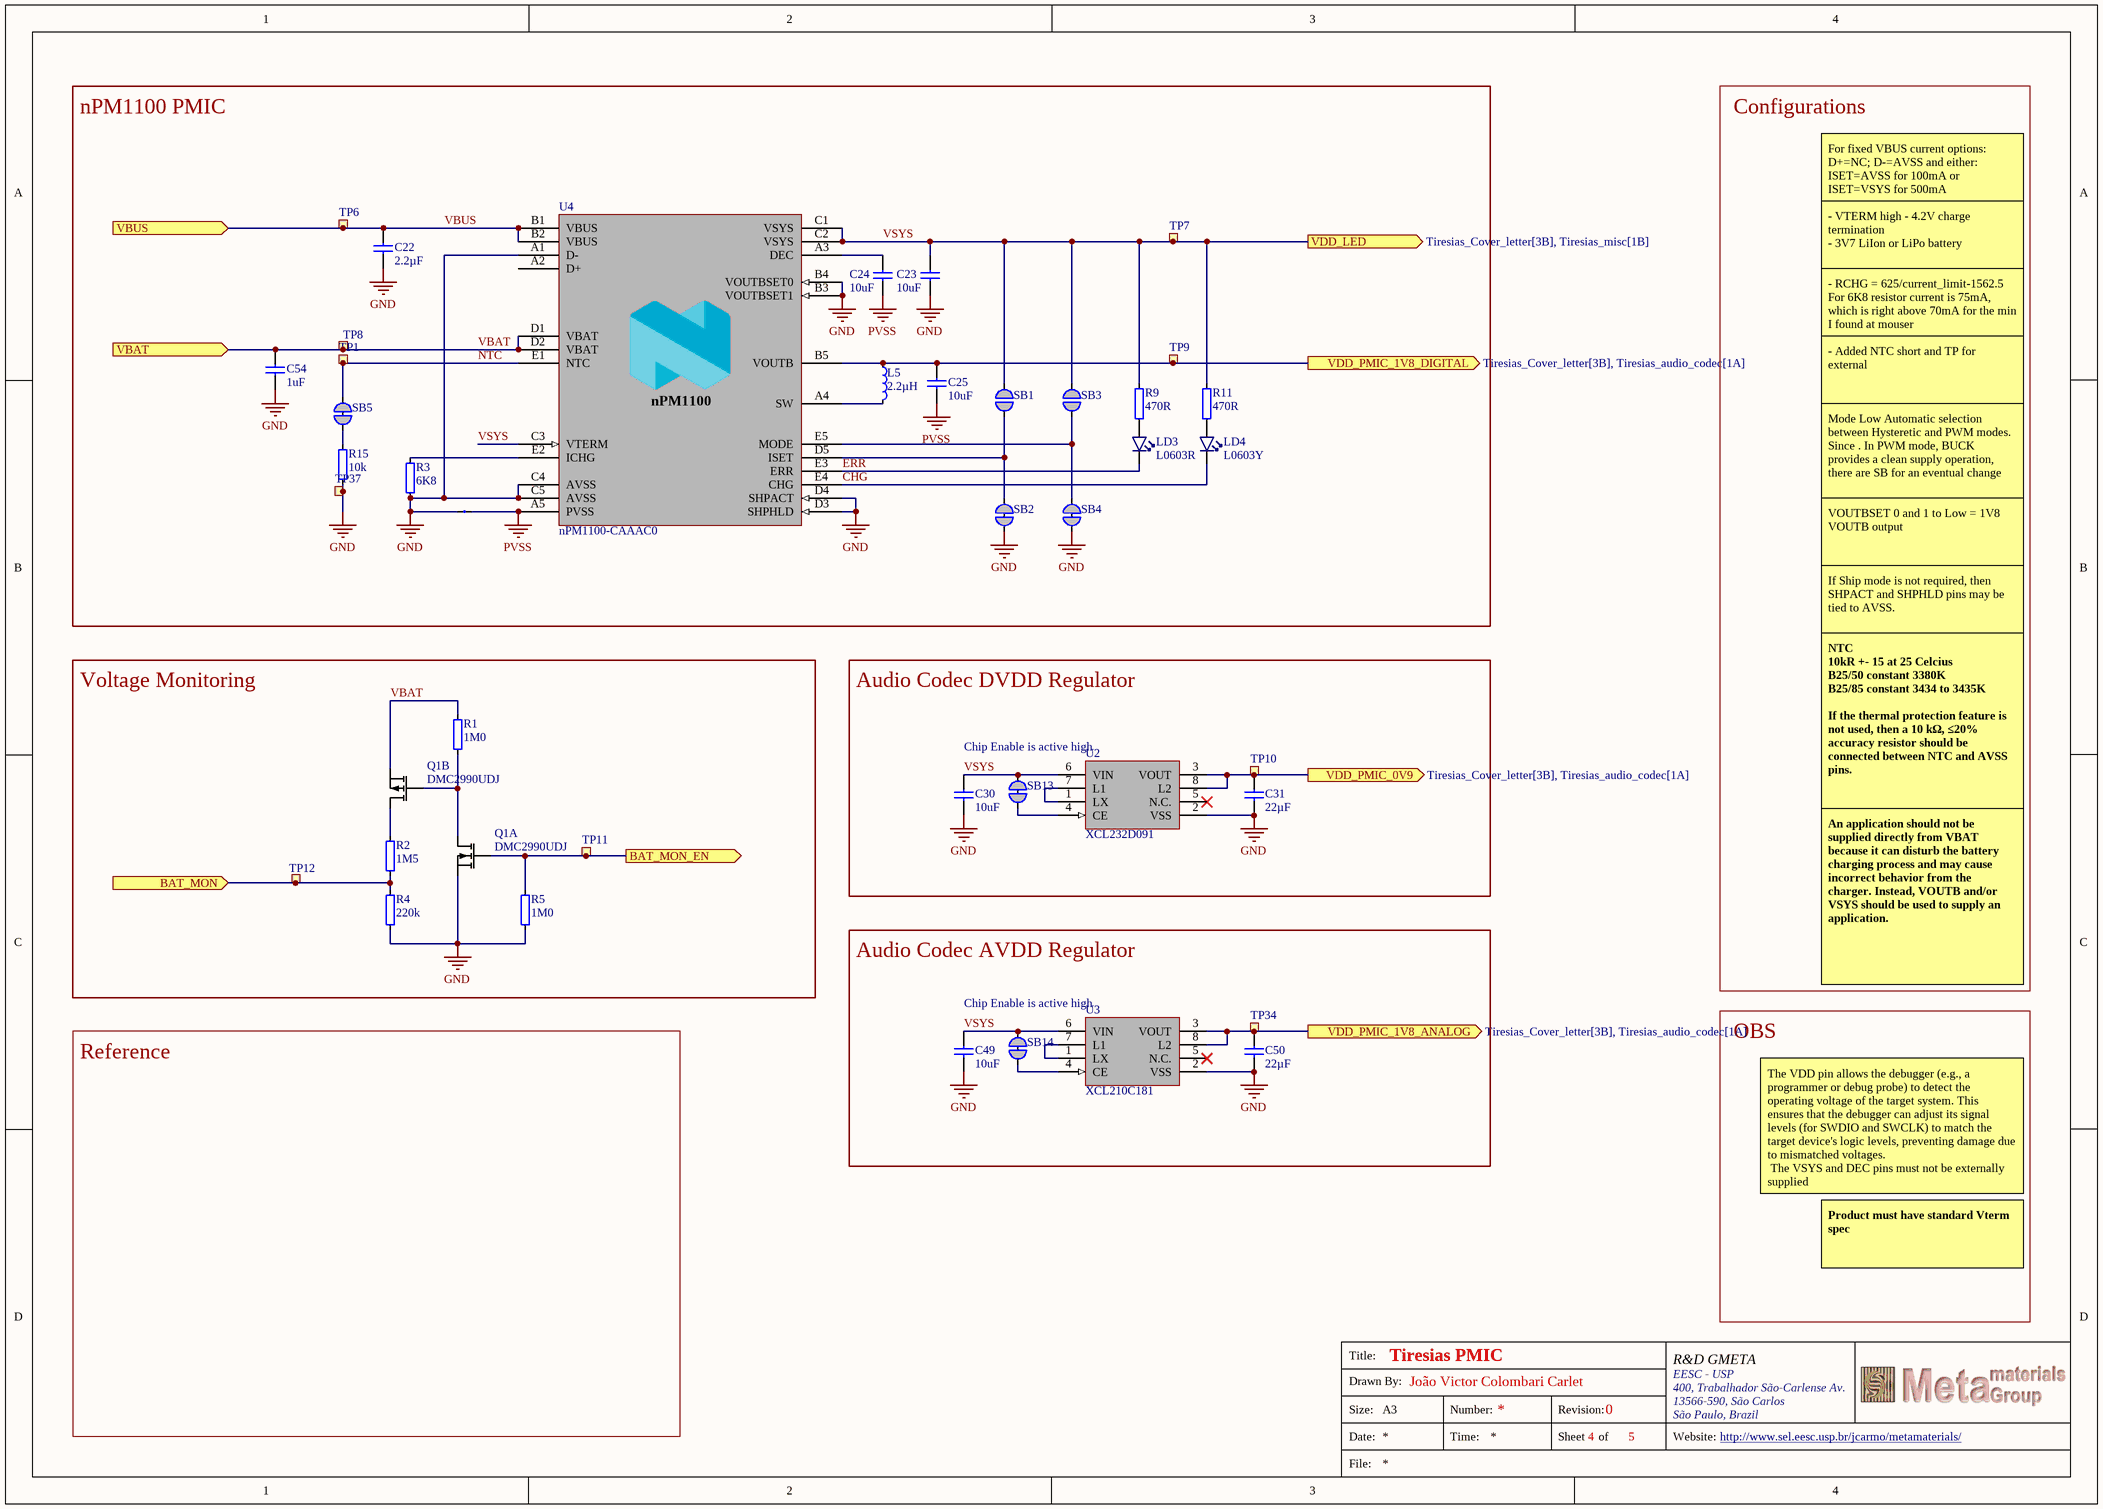
[diagram p3: Tiresias_PMIC.SchDoc]

### Parts
C22  2.2µF  [CAPC1608X06L]
C23  10uF  [CAPC1608X06L]
C24  10uF  [CAPC1608X06L]
C25  10uF  [CAPC1608X06L]
C30  10uF  [CAPC1608X06L]
C31  22µF  [CAPC1608X06L]
C49  10uF  [CAPC1608X06L]
C50  22µF  [CAPC1608X06L]
C54  1uF  [CAPC1005X04L]
J6  N.A.  [2 PIN STARPOINT]  (value not drawn)  (net tie, no BOM)
L5  2.2µH  [INDC2016X10N]
LD3  L0603R  [LED_0603_R]
LD4  L0603Y  [LED_0603_Y]
Q1  DMC2990UDJ  [SOTFL35P100X50-6N]  (parts A,B of 2)
R1  1M0  [RESC0603X03L_C]
R2  1M5  [RESC0603X03L_C]
R3  6K8  [RESC0603X03L_C]
R4  220k  [RESC0603X03L_C]
R5  1M0  [RESC0603X03L_C]
R9  470R  [RESC0603X03L_C]
R11  470R  [RESC0603X03L_C]
R15  10k  [RESC0603X03L_C]
SB1  Solderbridge  [Solderbridge]  (value not drawn)  (no BOM)
SB2  Solderbridge  [Solderbridge_Shorted]  (value not drawn)  (net tie, no BOM)
SB3  Solderbridge  [Solderbridge]  (value not drawn)  (no BOM)
SB4  Solderbridge  [Solderbridge_Shorted]  (value not drawn)  (net tie, no BOM)
SB5  Solderbridge  [Solderbridge_Shorted]  (value not drawn)  (net tie, no BOM)
SB13  Solderbridge  [Solderbridge_Shorted]  (value not drawn)  (net tie, no BOM)
SB14  Solderbridge  [Solderbridge_Shorted]  (value not drawn)  (net tie, no BOM)
TP1  Ø1.5mm,SMD  [TP_SMD_D1.5mm]  (value not drawn)  (no BOM)
TP6  Ø1.5mm,SMD  [TP_SMD_D1.5mm]  (value not drawn)  (no BOM)
TP7  Ø1.5mm,SMD  [TP_SMD_D1.5mm]  (value not drawn)  (no BOM)
TP8  Ø1.5mm,SMD  [TP_SMD_D1.5mm]  (value not drawn)  (no BOM)
TP9  Ø1.5mm,SMD  [TP_SMD_D1.5mm]  (value not drawn)  (no BOM)
TP10  Ø1.5mm,SMD  [TP_SMD_D1.5mm]  (value not drawn)  (no BOM)
TP11  Ø1.0mm,SMD  [TP_SMD_D1.0mm]  (value not drawn)  (no BOM)
TP12  Ø1.0mm,SMD  [TP_SMD_D1.0mm]  (value not drawn)  (no BOM)
TP34  Ø1.5mm,SMD  [TP_SMD_D1.5mm]  (value not drawn)  (no BOM)
TP37  Ø1.5mm,SMD  [TP_SMD_D1.5mm]  (value not drawn)  (no BOM)
U2  XCL232D091  [CL-2025]
U3  XCL210C181  [CL-2025]
U4  nPM1100-CAAAC0  [BGA25C40P5X5_200X200X50]

### Blocks framed on the sheet
nPM1100 PMIC: C22-C25 C54 J6 L5 LD3 LD4 R3 R9 R11 R15 SB1-SB5 TP1 TP6-TP9 TP37 U4
Voltage Monitoring: Q1 R1 R2 R4 R5 TP11 TP12
Audio Codec DVDD Regulator: C30 C31 SB13 TP10 U2
Audio Codec AVDD Regulator: C49 C50 SB14 TP34 U3

### Ports
BAT_MON (in, see Tiresias_Cover_letter[3B], Tiresias_MCU[4B]), BAT_MON_EN (out, see Tiresias_Cover_letter[3B], Tiresias_MCU[4B]), VBAT (in, see Tiresias_Cover_letter[3B], Tiresias_misc[1D]), VBUS (in, see Tiresias_Cover_letter[3B], Tiresias_misc[2D]), VDD_LED (out, see Tiresias_Cover_letter[3B], Tiresias_misc[1B]), VDD_PMIC_0V9 (out, see Tiresias_Cover_letter[3B], Tiresias_audio_codec[1A]), VDD_PMIC_1V8_ANALOG (out, see Tiresias_Cover_letter[3B], Tiresias_audio_codec[1A]), VDD_PMIC_1V8_DIGITAL (out, see Tiresias_Cover_letter[3B], Tiresias_audio_codec[1A])

### Nets
GND: C22.1 C23.1 C30.1 C31.1 C49.1 C50.1 C54.1 J6.1 Q1.1(S1) R3.2 R4.1 R5.1 R15.1 SB2.2 SB4.2 TP37.1 U2.2(VSS) U2.9(VSS) U3.2(VSS) U3.9(VSS) U4.A1(D-) U4.B3(VOUTBSET1) U4.B4(VOUTBSET0) U4.C4(AVSS) U4.C5(AVSS) U4.D3(SHPHLD) U4.D4(SHPACT)
PVSS: C24.1 C25.2 J6.2 U4.A5(PVSS)
VDD: C25.1 L5.1 TP9.1 U4.B5(VOUTB) ; port VDD_PMIC_1V8_DIGITAL
AVDD: C50.2 TP34.1 U3.3(VOUT) U3.8(L2) ; port VDD_PMIC_1V8_ANALOG
CHG: LD4.1(C) U4.E4(CHG)
DVDD_EXT: C31.2 TP10.1 U2.3(VOUT) U2.8(L2) ; port VDD_PMIC_0V9
ERR: LD3.1(C) U4.E3(ERR)
NTC: SB5.1 TP1.1 U4.E1(NTC)
P1.04: R2.1 R4.2 TP12.1 ; port BAT_MON
P1.05: Q1.2(G1) R5.2 TP11.1 ; port BAT_MON_EN
VBAT: C54.2 Q1.4(S2) R1.2 TP8.1 U4.D1(VBAT) U4.D2(VBAT) ; port VBAT
VBUS: C22.2 TP6.1 U4.B1(VBUS) U4.B2(VBUS) ; port VBUS
VSYS: C23.2 C30.2 C49.2 R9.2 R11.2 SB1.1 SB3.1 SB13.1 SB14.1 TP7.1 U2.6(VIN) U3.6(VIN) U4.C1(VSYS) U4.C2(VSYS) U4.C3(VTERM) ; port VDD_LED
NetC24_2: C24.2 U4.A3(DEC)
NetL5_2: L5.2 U4.A4(SW)
NetLD3_2: LD3.2(A) R9.1
NetLD4_2: LD4.2(A) R11.1
NetQ1_3: Q1.3(D2) R2.2
NetQ1_5: Q1.5(G2) Q1.6(D1) R1.1
NetR3_1: R3.1 U4.E2(ICHG)
NetR15_2: R15.2 SB5.2
NetSB1_2: SB1.2 SB2.1 U4.D5(ISET)
NetSB3_2: SB3.2 SB4.1 U4.E5(MODE)
NetSB13_2: SB13.2 U2.4(CE)
NetSB14_2: SB14.2 U3.4(CE)
NetU2_1: U2.1(LX) U2.7(L1)
NetU3_1: U3.1(LX) U3.7(L1)

Not connected (* = marked no-connect by the designer): U2 5(N.C.)*; U3 5(N.C.)*; U4 A2(D+)

### Notes on the sheet
- Configurations
- For fixed VBUS current options:
  D+=NC; D-=AVSS and either:
  ISET=AVSS for 100mA or
  ISET=VSYS for 500mA
- - VTERM high - 4.2V charge termination
  - 3V7 LiIon or LiPo battery
- - RCHG = 625/current_limit-1562.5
  For 6K8 resistor current is 75mA,
  which is right above 70mA for the min I found at mouser
- - Added NTC short and TP for external
- Mode Low Automatic selection between Hysteretic and PWM modes. Since . In PWM mode, BUCK provides a clean supply operation, there are SB for an eventual change
- VOUTBSET 0 and 1 to Low = 1V8 VOUTB output
- If Ship mode is not required, then SHPACT and SHPHLD pins may be tied to AVSS.
- Chip Enable is active high
- NTC
  10kR +- 15 at 25 Celcius
  B25/50 constant 3380K
  B25/85 constant 3434 to 3435K
  If the thermal protection feature is not used, then a 10 kΩ, ≤20% accuracy resistor should be connected between NTC and AVSS pins.
- An application should not be supplied directly from VBAT because it can disturb the battery charging process and may cause incorrect behavior from the charger. Instead, VOUTB and/or VSYS should be used to supply an application.
- OBS
- Reference
- The VDD pin allows the debugger (e.g., a programmer or debug probe) to detect the operating voltage of the target system. This ensures that the debugger can adjust its signal levels (for SWDIO and SWCLK) to match the target device's logic levels, preventing damage due to mismatched voltages.
  The VSYS and DEC pins must not be externally supplied
- Product must have standard Vterm spec
- Title:
- Drawn By:
- Size:
- Date:
- File:
- A3
- Number:
- Time:
- Revision:
- Sheet
- of
- Website:
- (in symbol nPM1100-CAAAC0) nPM1100

### Library data of the parts
C22 = CAP_0603_2u2F: Capacitor, Ceramic, X5R, ±10%, 10V; Part Number: C0603-2µ2-10V-X5R; Manufacturer: N.A.; Pad Count: 2; Footprint Doc: 0603; Value: 2.2µF; Component Class: Capacitors; Author: rubr; Manufacturer Part Number: N.A.; ComponentLink1URL: N.A.; ComponentLink1Description: Datasheet; ComponentLink2URL: N.A.; ComponentLink2Description: Supplier link; HelpURL: N.A.; LatestRevisionDate: 2021-07-22; Published: 2021-07-22; Note: 10V; Supplier 1: N.A.; Supplier Part Number 1: N.A.; Supplier 2: N.A.; Supplier Part Number 2: N.A.; Artikkelnr Noca: N.A.; Part number IPS: N.A.; Part number Norautron: N.A.
C23-C25 C30 C49 = CAP_0603_10uF: Capacitor, X5R, ±10%; Part Number: C0603-10µ; Class: SMT; Manufacturer: *; Manufacturer Part Number: *; LatestRevisionDate: 2024/02/20; Value: 10uF; Package: 0603; Pin Count: 2
C31 C50 = CAP_0603_22uF: Capacitor, X5R, ±20%, 6.3V; Part Number: C0603-22µ; Manufacturer: N.A.; Pad Count: 2; Manufacturer Part Number: N.A.; Footprint Doc: 0603; LatestRevisionDate: 2020-09-23; Published: 2020-09-23; Value: 22µF; Note: 6.3V; Artikkelnr Noca: N.A.; Part number IPS: N.A.; ComponentLink1URL: N.A.; ComponentLink1Description: Datasheet; ComponentLink2URL: N.A.; ComponentLink2Description: Supplier link; HelpURL: N.A.; Supplier 1: N.A.; Supplier Part Number 1: N.A.; Supplier 2: N.A.; Supplier Part Number 2: N.A.; Component Class: Capacitors; PartId: 100200276; Author: rsk; Part number Norautron: N.A.
C54 = CAP_0402_1uF: as C2 on sheet Tiresias_MCU; Manufacturer: *; Manufacturer Part Number: *; LatestRevisionDate: 2024/02/20; Value: 1uF; Package: 0402; Pin Count: 2
J6 = 2 pin starpoint: Starpoint; Pad Count: 2; Footprint Doc: N.A.; Value: N.A.; Component Class: Connectors; Author: rsk; Part Number: 2 pin starpoint; PartId: 100500603; Manufacturer: N.A.; Manufacturer Part Number: N.A.; ComponentLink1URL: N.A.; ComponentLink1Description: Datasheet; ComponentLink2URL: N.A.; ComponentLink2Description: Supplier link; HelpURL: N.A.; LatestRevisionDate: 2017-08-31; Published: 2017-08-31; Note: N.A.; Supplier 1: N.A.; Supplier Part Number 1: N.A.; Supplier 2: N.A.; Supplier Part Number 2: N.A.; Artikkelnr Noca: N.A.; Part number IPS: N.A.; Part number Norautron: N.A.
L5 = IND_0806_2u2H: FIXED IND 2.2UH 2.5A 87MOHM SMD; Part Number: CIGT201610EH2R2MNE; Manufacturer: Samsung Electro-Mechanics; Pad Count: 2; Note: 2.2µH Unshielded Thin Film Inductor 2.5A 87mOhm Max 0806 (2016 Metric); Artikkelnr Noca: N.A.; Footprint Doc: 0806; Value: 2.2µH; Component Class: Inductors; Author: rsk; PartId: 100300400; Manufacturer Part Number: CIGT201610EH2R2MNE; ComponentLink1URL: https://media.digikey.com/pdf/Data%20Sheets/Samsung%20PDFs/CIGT201610EH2R2MNE_Spec.pdf; ComponentLink1Description: Datasheet; ComponentLink2URL: https://www.digikey.com/en/products/detail/samsung-electro-mechanics/CIGT201610EH2R2MNE/7041223?s=N4IgTCBcDaIMIEkDiAVMAGAjANk%2BgogBJgBKYAsgHL4gC6AvkA; ComponentLink2Description: Supplier link; HelpURL: http://product.samsungsem.com/pi/CIGT201610EH2R2MN.do; LatestRevisionDate: 2021-02-03; Published: 2021-02-03; Supplier 1: Digi-Key; Supplier Part Number 1: 1276-6901-1-ND; Supplier 2: Mouser; Supplier Part Number 2: 187-CIGT201610EH2R2M; Part number IPS: N.A.; Part number Norautron: N.A.
LD3 = LED_0603_RED: LED, SMD, 0603, RED; Part Number: OVS-0608 RED; Manufacturer: Multicomp; Pad Count: 2; Note: 100 mcd @ 20 mA, Super bright; Artikkelnr Noca: N.A.; Footprint Doc: 0603; Value: L0603R; Component Class: Optoelectronics; Author: rsk; PartId: 101400024; Manufacturer Part Number: OVS-0608; ComponentLink1URL: N.A.; ComponentLink1Description: Datasheet; ComponentLink2URL: N.A.; ComponentLink2Description: Supplier link; HelpURL: http://www.farnell.com/datasheets/1673654.pdf; LatestRevisionDate: 2011-10-28; Published: 2011-10-28; Supplier 1: Farnell; Supplier Part Number 1: 171-6774; Supplier 2: N.A.; Supplier Part Number 2: N.A.; Part number IPS: N.A.; Part number Norautron: N.A.
LD4 = LED_0603_YEL: LED, Yellow, 0603, 590nm, Vf=2.0V, 120mcd, - 40 to +85°C; Part Number: 150060YS75000; Manufacturer: Wurth Elektronik; Note: N.A.; Pad Count: 2; Manufacturer Part Number: 150060YS75000; ComponentLink1URL: https://katalog.we-online.de/led/datasheet/150060YS75000.pdf; ComponentLink1Description: Datasheet; ComponentLink2URL: https://www.digikey.com/en/products/detail/w%C3%BCrth-elektronik/150060YS75000/4489909; ComponentLink2Description: Supplier link; HelpURL: N.A.; Footprint Doc: 0603; LatestRevisionDate: 2020-11-04; Published: 2020-11-04; Value: L0603Y; Supplier 1: Digi-Key; Supplier Part Number 1: 732-4981-1-ND; Supplier 2: N.A.; Supplier Part Number 2: N.A.; Artikkelnr Noca: N.A.; Part number IPS: N.A.; Component Class: Optoelectronics; PartId: 101400136; Author: rsk; Part number Norautron: N.A.
Q1 = DMC2990UDJ-7: MOSFET, Dual N and P-Channel, 20V, 450mA/310mA, 990mOhm, 350mW; Manufacturer: Diodes Incorporated; Part number IPS: 00000004489; Note: N.A.; Pad Count: 6; Part Number: DMC2990UDJ-7; Manufacturer Part Number: DMC2990UDJ-7; Footprint Doc: SOT-963; LatestRevisionDate: 2020-04-28; Published: 2020-02-21; Value: DMC2990UDJ; Artikkelnr Noca: N.A.; Supplier 1: Digi-Key; Supplier Part Number 1: DMC2990UDJ-7DICT-ND; Supplier 2: N.A.; Supplier Part Number 2: N.A.; ComponentLink1URL: https://www.diodes.com/assets/Datasheets/DMC2990UDJ.pdf; ComponentLink1Description: Datasheet; ComponentLink2URL: N.A.; ComponentLink2Description: Supplier link; HelpURL: N.A.; Component Class: Semiconductors; PartId: 101300174; Author: rsk; Part number Norautron: N.A.
R1 R5 = RES_0201_1M0: Resistor, ±1%, 0.05W; Part Number: R0201-100k; Manufacturer: N.A.; Class: SMT; Latest Revision Date: 2024-04-23; ComponentLink1URL: N.A.; ComponentLink1Description: Datasheet; ComponentLink2URL: N.A.; ComponentLink2Description: Supplier link; Value: 1M0; Package: 0201; Pin Count: 2; JLCpcb link: Chip Res 1%; Mouser link: N.A.; DigiKey link: 00000001419; Author: rsk
R2 = RES_0201_1M5: Resistor, ±1%, 0.05W; Part Number: R0201-100k; Manufacturer: N.A.; Class: SMT; Latest Revision Date: 2024-04-23; ComponentLink1URL: N.A.; ComponentLink1Description: Datasheet; ComponentLink2URL: N.A.; ComponentLink2Description: Supplier link; Value: 1M5; Package: 0201; Pin Count: 2; JLCpcb link: Chip Res 1%; Mouser link: N.A.; DigiKey link: 00000001419; Author: rsk
R3 = RES_0201_6K8: Resistor, ±1%, 0.05W; Part Number: R0201-100k; Manufacturer: N.A.; Class: SMT; Latest Revision Date: 2024-04-23; ComponentLink1URL: N.A.; ComponentLink1Description: Datasheet; ComponentLink2URL: N.A.; ComponentLink2Description: Supplier link; Value: 6K8; Package: 0201; Pin Count: 2; JLCpcb link: Chip Res 1%; Mouser link: N.A.; DigiKey link: 00000001419; Author: rsk
R4 = RES_0201_220K: Resistor, ±1%, 0.05W; Part Number: R0201-100k; Manufacturer: N.A.; Class: SMT; Latest Revision Date: 2024-04-23; ComponentLink1URL: N.A.; ComponentLink1Description: Datasheet; ComponentLink2URL: N.A.; ComponentLink2Description: Supplier link; Value: 220k; Package: 0201; Pin Count: 2; JLCpcb link: Chip Res 1%; Mouser link: N.A.; DigiKey link: 00000001419; Author: rsk
R9 R11 = RES_0201_470R: Resistor, ±1%, 0.05W; Part Number: R0201-470; Manufacturer: N.A.; Note: Chip Res 1%; Pad Count: 2; Manufacturer Part Number: N.A.; ComponentLink1URL: N.A.; ComponentLink1Description: Datasheet; ComponentLink2URL: N.A.; ComponentLink2Description: Supplier link; HelpURL: N.A.; Footprint Doc: 0201; LatestRevisionDate: 2014-11-13; Published: 2014-11-13; Value: 470R; Artikkelnr Noca: N.A.; Part number IPS: N.A.; Supplier 1: N.A.; Supplier Part Number 1: N.A.; Supplier 2: N.A.; Supplier Part Number 2: N.A.; Component Class: Resistors; PartId: 100100037; Author: rsk; Part number Norautron: N.A.
R15 = RES_0201_10K: as R14 on sheet Tiresias_audio_codec; Latest Revision Date: 2024-04-23; ComponentLink1URL: N.A.; ComponentLink1Description: Datasheet; ComponentLink2URL: N.A.; ComponentLink2Description: Supplier link; Value: 10k; Package: 0201; Pin Count: 2; JLCpcb link: Chip Res 1%; Mouser link: N.A.; DigiKey link: 00000001419; Author: rsk
SB1 SB3 = Solderbridge: Manufacturer: N.A.; Pad Count: 2; Part Number: Solderbridge; Manufacturer Part Number: N.A.; ComponentLink1URL: N.A.; ComponentLink1Description: Datasheet; ComponentLink2URL: N.A.; ComponentLink2Description: Supplier link; HelpURL: N.A.; Footprint Doc: Solderbridge; LatestRevisionDate: 2009-12-14; Published: 2009-12-14; Value: Solderbridge; Note: N.A.; Supplier 1: N.A.; Supplier Part Number 1: N.A.; Supplier 2: N.A.; Supplier Part Number 2: N.A.; Artikkelnr Noca: N.A.; Part number IPS: N.A.; Component Class: Connectors; PartId: 100500458; Author: rsk; Part number Norautron: N.A.
SB2 SB4 SB5 SB13 SB14 = Solderbridge Shorted: as SB8 on sheet Tiresias_audio_codec; Part Number: Solderbridge Shorted; Manufacturer Part Number: N.A.; ComponentLink1URL: N.A.; ComponentLink1Description: Datasheet; ComponentLink2URL: N.A.; ComponentLink2Description: Supplier link; HelpURL: N.A.; Footprint Doc: Solderbridge_Shorted; LatestRevisionDate: 2012-08-07; Published: 2012-08-07; Value: Solderbridge; Note: N.A.; Supplier 1: N.A.; Supplier Part Number 1: N.A.; Supplier 2: N.A.; Supplier Part Number 2: N.A.; Artikkelnr Noca: N.A.; Part number IPS: N.A.; Component Class: Connectors; PartId: 100500459; Author: rsk; Part number Norautron: N.A.
TP1 TP6-TP10 TP34 TP37 = TP_SMD_Ø1.5MM: 1.5mm circular SMD testpad; Manufacturer: Nordic Semiconductor; Manufacturer Part Number: N.A.; Pad Count: 1; Part Number: TP_SMD_Ø1.5MM; LatestRevisionDate: 2021-03-05; Published: 2016-06-02; Value: Ø1.5mm,SMD; Note: N.A.; Artikkelnr Noca: N.A.; Footprint Doc: TP_SMD_Ø1.5mm; Part number IPS: N.A.; ComponentLink1URL: N.A.; ComponentLink1Description: Datasheet; ComponentLink2URL: N.A.; ComponentLink2Description: Supplier link; HelpURL: N.A.; Supplier 1: N.A.; Supplier Part Number 1: N.A.; Supplier 2: N.A.; Supplier Part Number 2: N.A.; Component Class: Connectors; PartId: 100500477; Author: rsk; Part number Norautron: N.A.
TP11 TP12 = TP_SMD_Ø1.0MM: as TP29 on sheet Tiresias_MCU; Part Number: TP_SMD_Ø1.0MM; ComponentLink1URL: N.A.; ComponentLink1Description: Datasheet; ComponentLink2URL: N.A.; ComponentLink2Description: Supplier link; HelpURL: N.A.; Footprint Doc: TP_SMD_Ø1.0mm; LatestRevisionDate: 2021-03-05; Published: 2013-06-11; Value: Ø1.0mm,SMD; Note: N.A.; Supplier 1: N.A.; Supplier Part Number 1: N.A.; Supplier 2: N.A.; Supplier Part Number 2: N.A.; Artikkelnr Noca: N.A.; Part number IPS: N.A.; Component Class: Connectors; PartId: 100500475; Author: rsk; Part number Norautron: N.A.
U2 = XCL232D091KR-G: 0.9V Ultra-Low Quiescent Current, Inductor Built-in Step-Down DC/DC Converter, CL-2025-03   Source:  Datasheet; Part Number: XCL210C12; Manufacturer: Torex Semiconductor; Manufacturer Part Number: XCL210C121GR-G; Note: N.A.; Pad Count: 8; Footprint Doc: CL-2025; LatestRevisionDate: 2021-04-22; Published: 2021-04-22; Value: XCL232D091; Artikkelnr Noca: N.A.; Part number IPS: N.A.; ComponentLink1URL: https://www.torexsemi.com/file/xcl210/XCL210.pdf; ComponentLink1Description: Datasheet; ComponentLink2URL: https://www.digikey.com/en/products/detail/torex-semiconductor-ltd/XCL210C121GR-G/5964723; ComponentLink2Description: Supplier link; HelpURL: https://www.torexsemi.com/products/built-in-dcdc-converters/series/?name=xcl210; Supplier 1: Digi-Key; Supplier Part Number 1: 893-1249-1-ND; Supplier 2: Mouser; Supplier Part Number 2: 865-XCL210C121GR-G; Component Class: Misc_ICs; Author: rubr; Part number Norautron: N.A.; PartId: 101900655; Mouser Link: https://au.mouser.com/ProductDetail/Torex-Semiconductor/XCL210D201GR-G?qs=AsjdqWjXhJ%252Bfq4YmN5RHyA%3D%3D&_gl=1*8wexd*_ga*MTYyMjg1NzA0OC4xNzEzODc4NTc0*_ga_15W4STQT4T*MTcxMzk3OTMxMS4zLjAuMTcxMzk3OTMxMi41OS4wLjA.; Digikey Link: https://www.digikey.com/en/products/detail/torex-semiconductor-ltd/XCL210D201GR-G/10148097?s=N4IgTCBcDaIBoGEAyYCMAGAImdqDiASgLR4gC6AvkA
U3 = XCL210C18: 1.8V, 200mA Inductor Built-in Step-Down “micro DC/DC” Converter; Part Number: XCL210C12; Manufacturer: Torex Semiconductor; Manufacturer Part Number: XCL210C121GR-G; Note: N.A.; Pad Count: 8; Footprint Doc: CL-2025; LatestRevisionDate: 2021-04-22; Published: 2021-04-22; Value: XCL210C181; Artikkelnr Noca: N.A.; Part number IPS: N.A.; ComponentLink1URL: https://www.torexsemi.com/file/xcl210/XCL210.pdf; ComponentLink1Description: Datasheet; ComponentLink2URL: https://www.digikey.com/en/products/detail/torex-semiconductor-ltd/XCL210C121GR-G/5964723; ComponentLink2Description: Supplier link; HelpURL: https://www.torexsemi.com/products/built-in-dcdc-converters/series/?name=xcl210; Supplier 1: Digi-Key; Supplier Part Number 1: 893-1249-1-ND; Supplier 2: Mouser; Supplier Part Number 2: 865-XCL210C121GR-G; Component Class: Misc_ICs; Author: rubr; Part number Norautron: N.A.; PartId: 101900655; Mouser Link: https://au.mouser.com/ProductDetail/Torex-Semiconductor/XCL210D201GR-G?qs=AsjdqWjXhJ%252Bfq4YmN5RHyA%3D%3D&_gl=1*8wexd*_ga*MTYyMjg1NzA0OC4xNzEzODc4NTc0*_ga_15W4STQT4T*MTcxMzk3OTMxMS4zLjAuMTcxMzk3OTMxMi41OS4wLjA.; Digikey Link: https://www.digikey.com/en/products/detail/torex-semiconductor-ltd/XCL210D201GR-G/10148097?s=N4IgTCBcDaIBoGEAyYCMAGAImdqDiASgLR4gC6AvkA
U4 = nPM1100-CAAAC0: Li-Ion/Li-Polymer USB battery charger with a high efficiency buck regulator; Manufacturer: Nordic Semiconductor; Pad Count: 25; Note: N.A.; Footprint Doc: WLCSP-25; Value: nPM1100-CAAAC0; Component Class: nRF_Devices; Author: rubr; Part Number: nPM1100-CAAAC0; Manufacturer Part Number: nPM1100-CAAAC0; ComponentLink1URL: N.A.; ComponentLink1Description: Datasheet; ComponentLink2URL: N.A.; ComponentLink2Description: Supplier link; HelpURL: N.A.; LatestRevisionDate: 2021-04-21; Published: 2021-04-21; Supplier 1: Nordic Semiconductor; Supplier Part Number 1: N.A.; Supplier 2: N.A.; Supplier Part Number 2: N.A.; Artikkelnr Noca: N.A.; Part number IPS: N.A.; Part number Norautron: N.A.; PartId: 102000225